# Altium project FPGA2.PrjPcb (part 1 of 2)
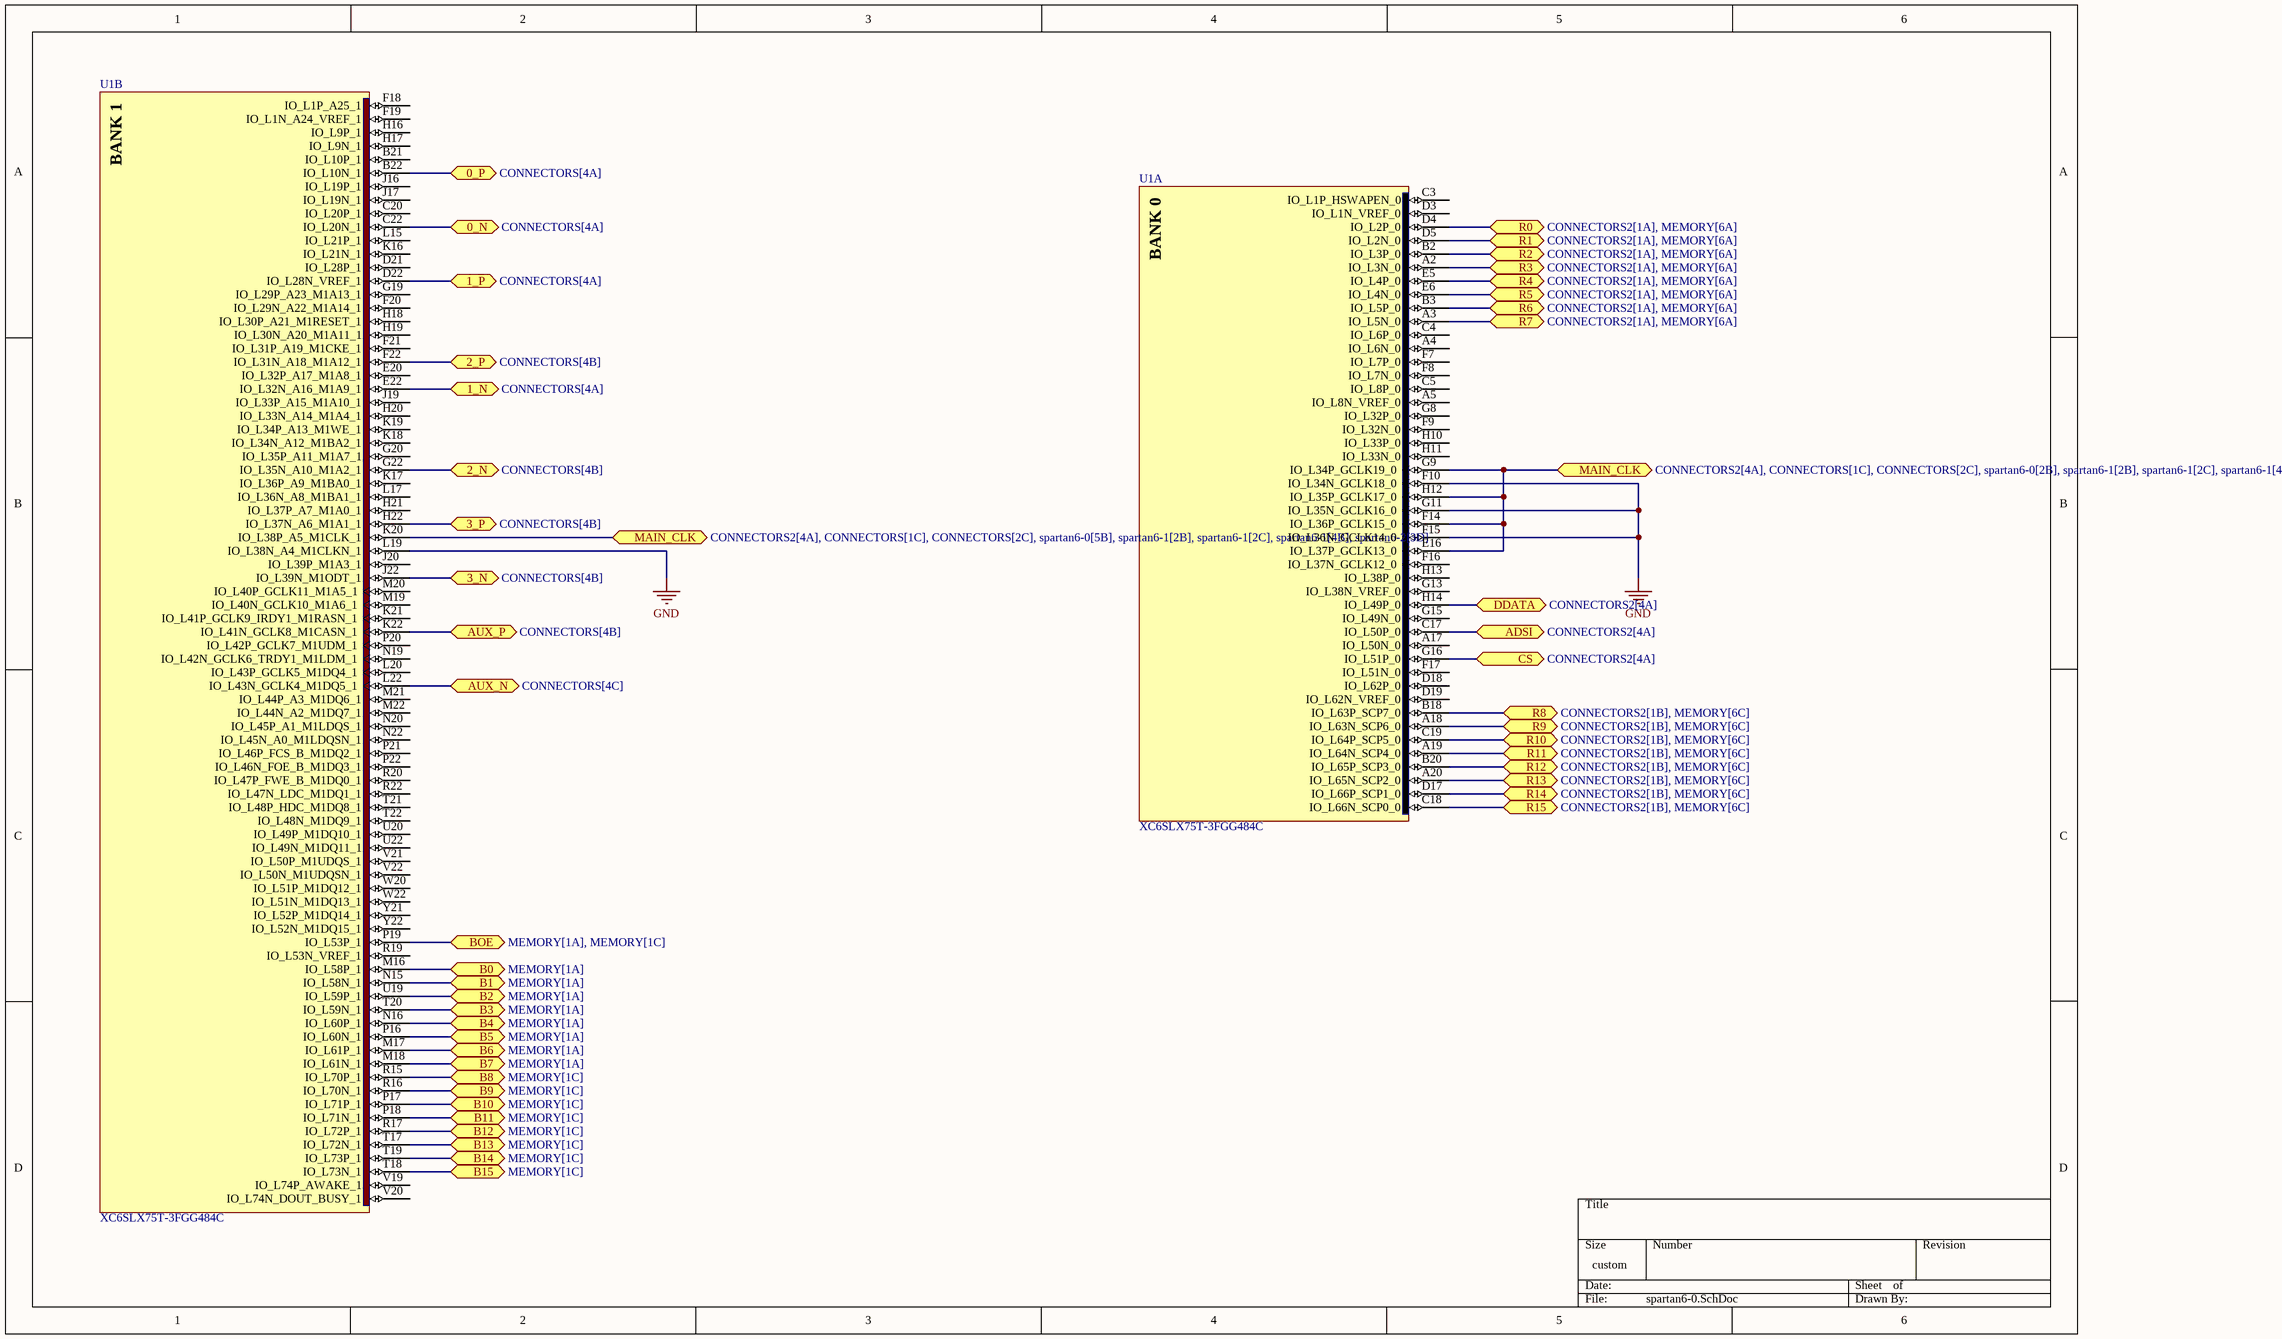
[diagram p0: spartan6-0.SchDoc]
8 sheets, 86 parts. Net scope: flat (ports and power ports of the same name join across sheets).
Board file: SPARTAN-6.PcbDoc
Sheets:
  spartan6-0.SchDoc
  spartan6-1.SchDoc
  spartan6-2.SchDoc
  MEMORY.SchDoc
  POWER.SchDoc
  CONNECTORS.SchDoc
  CONNECTORS2.SchDoc
  MODULES.SchDoc

## Sheet spartan6-0.SchDoc
size 389 x 250 mm; SheetNumber: 1; SheetTotal: 8

### Parts
U1  XC6SLX75T-3FGG484C  [FGG484]  (parts A,B of 9)

### Ports
0_N (bidir, see CONNECTORS[4A]), 0_P (bidir, see CONNECTORS[4A]), 1_N (bidir, see CONNECTORS[4A]), 1_P (bidir, see CONNECTORS[4A]), 2_N (bidir, see CONNECTORS[4B]), 2_P (bidir, see CONNECTORS[4B]), 3_N (bidir, see CONNECTORS[4B]), 3_P (bidir, see CONNECTORS[4B]), ADSI (bidir, see CONNECTORS2[4A]), AUX_N (bidir, see CONNECTORS[4C]), AUX_P (bidir, see CONNECTORS[4B]), B0 (bidir, see MEMORY[1A]), B1 (bidir, see MEMORY[1A]), B2 (bidir, see MEMORY[1A]), B3 (bidir, see MEMORY[1A]), B4 (bidir, see MEMORY[1A]), B5 (bidir, see MEMORY[1A]), B6 (bidir, see MEMORY[1A]), B7 (bidir, see MEMORY[1A]), B8 (bidir, see MEMORY[1C]), B9 (bidir, see MEMORY[1C]), B10 (bidir, see MEMORY[1C]), B11 (bidir, see MEMORY[1C]), B12 (bidir, see MEMORY[1C]), B13 (bidir, see MEMORY[1C]), B14 (bidir, see MEMORY[1C]), B15 (bidir, see MEMORY[1C]), BOE (bidir, see MEMORY[1A], MEMORY[1C]), CS (bidir, see CONNECTORS2[4A]), DDATA (bidir, see CONNECTORS2[4A]), MAIN_CLK (bidir, see CONNECTORS2[4A], CONNECTORS[1C], CONNECTORS[2C], spartan6-0[2B], spartan6-1[2B], spartan6-1[2C], spartan6-1[4B], spartan6-2[3D]), MAIN_CLK (bidir, see CONNECTORS2[4A], CONNECTORS[1C], CONNECTORS[2C], spartan6-0[5B], spartan6-1[2B], spartan6-1[2C], spartan6-1[4B], spartan6-2[3D]), R0 (bidir, see CONNECTORS2[1A], MEMORY[6A]), R1 (bidir, see CONNECTORS2[1A], MEMORY[6A]), R2 (bidir, see CONNECTORS2[1A], MEMORY[6A]), R3 (bidir, see CONNECTORS2[1A], MEMORY[6A]), R4 (bidir, see CONNECTORS2[1A], MEMORY[6A]), R5 (bidir, see CONNECTORS2[1A], MEMORY[6A]), R6 (bidir, see CONNECTORS2[1A], MEMORY[6A]), R7 (bidir, see CONNECTORS2[1A], MEMORY[6A]), R8 (bidir, see CONNECTORS2[1B], MEMORY[6C]), R9 (bidir, see CONNECTORS2[1B], MEMORY[6C]), R10 (bidir, see CONNECTORS2[1B], MEMORY[6C]), R11 (bidir, see CONNECTORS2[1B], MEMORY[6C]), R12 (bidir, see CONNECTORS2[1B], MEMORY[6C]), R13 (bidir, see CONNECTORS2[1B], MEMORY[6C]), R14 (bidir, see CONNECTORS2[1B], MEMORY[6C]), R15 (bidir, see CONNECTORS2[1B], MEMORY[6C])

### Nets
GND: U1.F10(IO_L34N_GCLK18_0) U1.F15(IO_L36N_GCLK14_0) U1.G11(IO_L35N_GCLK16_0) U1.L19(IO_L38N_A4_M1CLKN_1)
0_N: U1.C22(IO_L20N_1) ; port 0_N
0_P: U1.B22(IO_L10N_1) ; port 0_P
1_N: U1.E22(IO_L32N_A16_M1A9_1) ; port 1_N
1_P: U1.D22(IO_L28N_VREF_1) ; port 1_P
2_N: U1.G22(IO_L35N_A10_M1A2_1) ; port 2_N
2_P: U1.F22(IO_L31N_A18_M1A12_1) ; port 2_P
3_N: U1.J22(IO_L39N_M1ODT_1) ; port 3_N
3_P: U1.H22(IO_L37N_A6_M1A1_1) ; port 3_P
AUX_N: U1.L22(IO_L43N_GCLK4_M1DQ5_1) ; port AUX_N
AUX_P: U1.K22(IO_L41N_GCLK8_M1CASN_1) ; port AUX_P
clk: U1.E16(IO_L37P_GCLK13_0) U1.F14(IO_L36P_GCLK15_0) U1.G9(IO_L34P_GCLK19_0) U1.H12(IO_L35P_GCLK17_0) U1.K20(IO_L38P_A5_M1CLK_1) ; port MAIN_CLK
NetJ4_3: U1.A3(IO_L5N_0) ; port R7
NetJ4_4: U1.B3(IO_L5P_0) ; port R6
NetJ4_5: U1.E6(IO_L4N_0) ; port R5
NetJ4_6: U1.E5(IO_L4P_0) ; port R4
NetJ4_7: U1.A2(IO_L3N_0) ; port R3
NetJ4_8: U1.B2(IO_L3P_0) ; port R2
NetJ4_9: U1.D5(IO_L2N_0) ; port R1
NetJ4_10: U1.D4(IO_L2P_0) ; port R0
NetJ5_3: U1.B18(IO_L63P_SCP7_0) ; port R8
NetJ5_4: U1.A18(IO_L63N_SCP6_0) ; port R9
NetJ5_5: U1.C19(IO_L64P_SCP5_0) ; port R10
NetJ5_6: U1.A19(IO_L64N_SCP4_0) ; port R11
NetJ5_7: U1.B20(IO_L65P_SCP3_0) ; port R12
NetJ5_8: U1.A20(IO_L65N_SCP2_0) ; port R13
NetJ5_9: U1.D17(IO_L66P_SCP1_0) ; port R14
NetJ5_10: U1.C18(IO_L66N_SCP0_0) ; port R15
NetR10_2: U1.P19(IO_L53P_1) ; port BOE
NetU1_C17: U1.C17(IO_L50P_0) ; port ADSI
NetU1_G16: U1.G16(IO_L51P_0) ; port CS
NetU1_H14: U1.H14(IO_L49P_0) ; port DDATA
NetU1_M16: U1.M16(IO_L58P_1) ; port B0
NetU1_M17: U1.M17(IO_L61P_1) ; port B6
NetU1_M18: U1.M18(IO_L61N_1) ; port B7
NetU1_N15: U1.N15(IO_L58N_1) ; port B1
NetU1_N16: U1.N16(IO_L60P_1) ; port B4
NetU1_P16: U1.P16(IO_L60N_1) ; port B5
NetU1_P17: U1.P17(IO_L71P_1) ; port B10
NetU1_P18: U1.P18(IO_L71N_1) ; port B11
NetU1_R15: U1.R15(IO_L70P_1) ; port B8
NetU1_R16: U1.R16(IO_L70N_1) ; port B9
NetU1_R17: U1.R17(IO_L72P_1) ; port B12
NetU1_T17: U1.T17(IO_L72N_1) ; port B13
NetU1_T18: U1.T18(IO_L73N_1) ; port B15
NetU1_T19: U1.T19(IO_L73P_1) ; port B14
NetU1_T20: U1.T20(IO_L59N_1) ; port B3
NetU1_U19: U1.U19(IO_L59P_1) ; port B2

Not connected (* = marked no-connect by the designer): U1 A4(IO_L6N_0) A5(IO_L8N_VREF_0) A17(IO_L50N_0) B21(IO_L10P_1) C3(IO_L1P_HSWAPEN_0) C4(IO_L6P_0) C5(IO_L8P_0) C20(IO_L20P_1) D3(IO_L1N_VREF_0) D18(IO_L62P_0) D19(IO_L62N_VREF_0) D21(IO_L28P_1) E20(IO_L32P_A17_M1A8_1) F7(IO_L7P_0) F8(IO_L7N_0) F9(IO_L32N_0) F16(IO_L37N_GCLK12_0) F17(IO_L51N_0) F18(IO_L1P_A25_1) F19(IO_L1N_A24_VREF_1) F20(IO_L29N_A22_M1A14_1) F21(IO_L31P_A19_M1CKE_1) G8(IO_L32P_0) G13(IO_L38N_VREF_0) G15(IO_L49N_0) G19(IO_L29P_A23_M1A13_1) G20(IO_L35P_A11_M1A7_1) H10(IO_L33P_0) H11(IO_L33N_0) H13(IO_L38P_0) H16(IO_L9P_1) H17(IO_L9N_1) H18(IO_L30P_A21_M1RESET_1) H19(IO_L30N_A20_M1A11_1) H20(IO_L33N_A14_M1A4_1) H21(IO_L37P_A7_M1A0_1) J16(IO_L19P_1) J17(IO_L19N_1) J19(IO_L33P_A15_M1A10_1) J20(IO_L39P_M1A3_1) K16(IO_L21N_1) K17(IO_L36P_A9_M1BA0_1) K18(IO_L34N_A12_M1BA2_1) K19(IO_L34P_A13_M1WE_1) K21(IO_L41P_GCLK9_IRDY1_M1RASN_1) L15(IO_L21P_1) L17(IO_L36N_A8_M1BA1_1) L20(IO_L43P_GCLK5_M1DQ4_1) M19(IO_L40N_GCLK10_M1A6_1) M20(IO_L40P_GCLK11_M1A5_1) M21(IO_L44P_A3_M1DQ6_1) M22(IO_L44N_A2_M1DQ7_1) N19(IO_L42N_GCLK6_TRDY1_M1LDM_1) N20(IO_L45P_A1_M1LDQS_1) N22(IO_L45N_A0_M1LDQSN_1) P20(IO_L42P_GCLK7_M1UDM_1) P21(IO_L46P_FCS_B_M1DQ2_1) P22(IO_L46N_FOE_B_M1DQ3_1) R19(IO_L53N_VREF_1) R20(IO_L47P_FWE_B_M1DQ0_1) R22(IO_L47N_LDC_M1DQ1_1) T21(IO_L48P_HDC_M1DQ8_1) T22(IO_L48N_M1DQ9_1) U20(IO_L49P_M1DQ10_1) U22(IO_L49N_M1DQ11_1) V19(IO_L74P_AWAKE_1) V20(IO_L74N_DOUT_BUSY_1) V21(IO_L50P_M1UDQS_1) V22(IO_L50N_M1UDQSN_1) W20(IO_L51P_M1DQ12_1) W22(IO_L51N_M1DQ13_1) Y21(IO_L52P_M1DQ14_1) Y22(IO_L52N_M1DQ15_1)

### Notes on the sheet
- (in symbol CMP-0067-00082-1, part A) BANK 0
- (in symbol CMP-0067-00082-1, part B) BANK 1

### Library data of the parts
U1 = CMP-0067-00082-1: Spartan-6 LXT 1.2V FPGA, 268 User I/Os, 484-Ball Fine-Pitch BGA (1.0mm Pitch), Speed Grade 3, Commercial Grade, Pb-Free; PackageDescription: 484-Ball Fine Pitch Ball Grid Array 1.00 mm Pitch (FGG484) - Pb-Free; PackageVersion: ver1.1, Dec-2008; DatasheetVersion: ver1.6, Nov-2010; Code_JEDEC: MS-034-AAJ-1; Code_IPC: BGA100P22X22-484; PackageReference: FGG484

## Sheet spartan6-1.SchDoc
size 389 x 250 mm; SheetNumber: 2; SheetTotal: 8
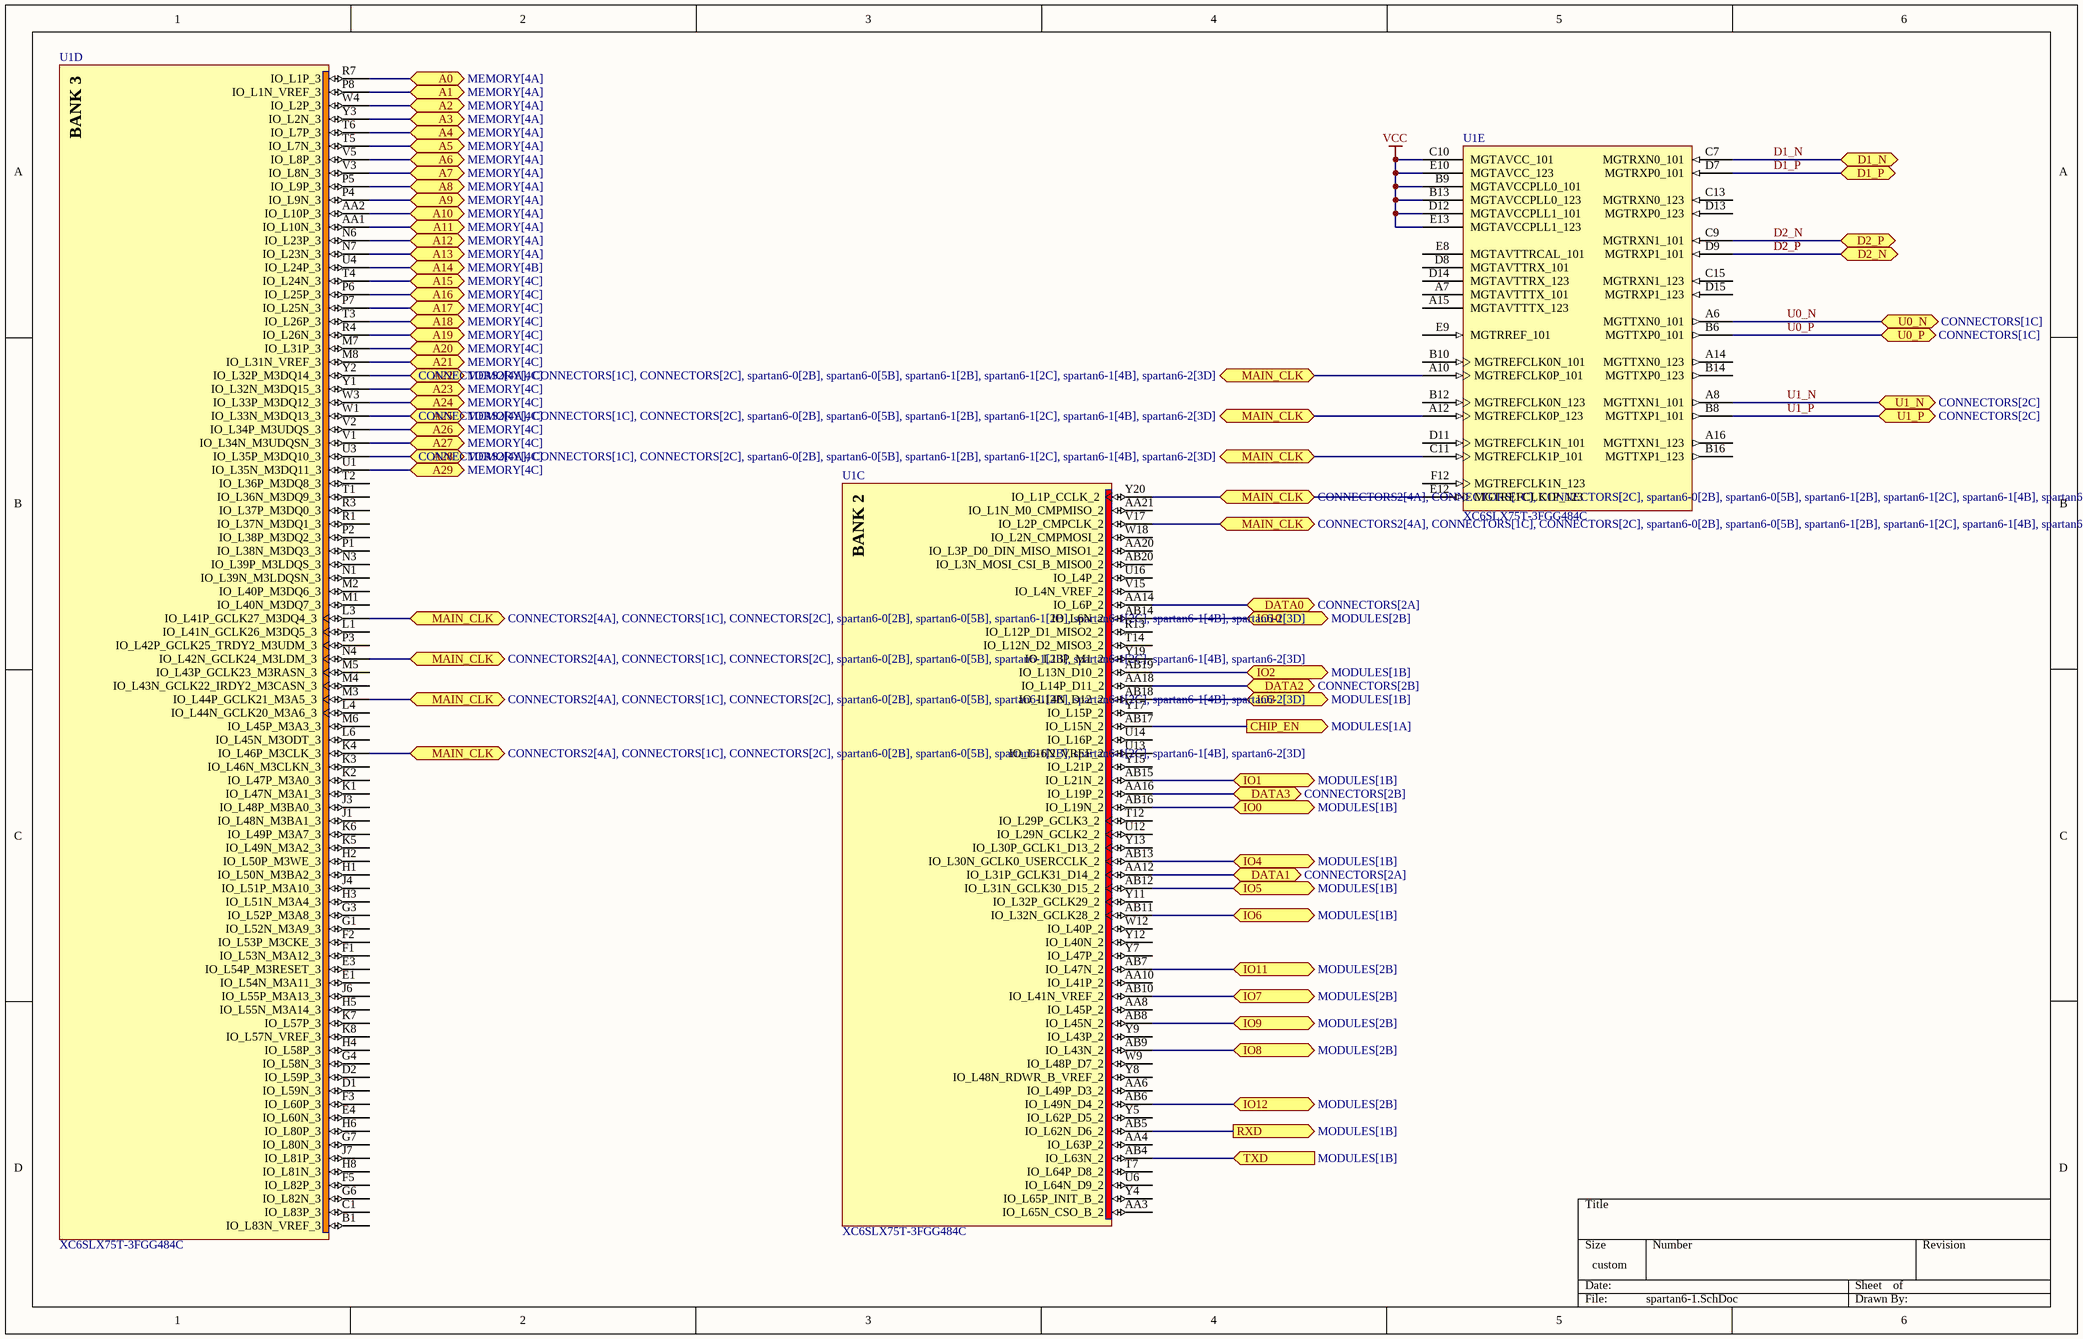
[diagram p1: spartan6-1.SchDoc]

### Parts
U1  XC6SLX75T-3FGG484C  [FGG484]  (parts C,D,E of 9)

### Ports
A0 (bidir, see MEMORY[4A]), A1 (bidir, see MEMORY[4A]), A2 (bidir, see MEMORY[4A]), A3 (bidir, see MEMORY[4A]), A4 (bidir, see MEMORY[4A]), A5 (bidir, see MEMORY[4A]), A6 (bidir, see MEMORY[4A]), A7 (bidir, see MEMORY[4A]), A8 (bidir, see MEMORY[4A]), A9 (bidir, see MEMORY[4A]), A10 (bidir, see MEMORY[4A]), A11 (bidir, see MEMORY[4A]), A12 (bidir, see MEMORY[4A]), A13 (bidir, see MEMORY[4A]), A14 (bidir, see MEMORY[4B]), A15 (bidir, see MEMORY[4C]), A16 (bidir, see MEMORY[4C]), A17 (bidir, see MEMORY[4C]), A18 (bidir, see MEMORY[4C]), A19 (bidir, see MEMORY[4C]), A20 (bidir, see MEMORY[4C]), A21 (bidir, see MEMORY[4C]), A22 (bidir, see MEMORY[4C]), A23 (bidir, see MEMORY[4C]), A24 (bidir, see MEMORY[4C]), A25 (bidir, see MEMORY[4C]), A26 (bidir, see MEMORY[4C]), A27 (bidir, see MEMORY[4C]), A28 (bidir, see MEMORY[4C]), A29 (bidir, see MEMORY[4C]), CHIP_EN (out, see MODULES[1A]), D1_N (bidir), D1_P (bidir), D2_N (bidir), D2_P (bidir), DATA0 (bidir, see CONNECTORS[2A]), DATA1 (bidir, see CONNECTORS[2A]), DATA2 (bidir, see CONNECTORS[2B]), DATA3 (bidir, see CONNECTORS[2B]), IO0 (bidir, see MODULES[1B]), IO1 (bidir, see MODULES[1B]), IO2 (bidir, see MODULES[1B]), IO3 (bidir, see MODULES[1B]), IO4 (bidir, see MODULES[1B]), IO5 (bidir, see MODULES[1B]), IO6 (bidir, see MODULES[1B]), IO7 (bidir, see MODULES[2B]), IO8 (bidir, see MODULES[2B]), IO9 (bidir, see MODULES[2B]), IO10 (bidir, see MODULES[2B]), IO11 (bidir, see MODULES[2B]), IO12 (bidir, see MODULES[2B]), MAIN_CLK (bidir, see CONNECTORS2[4A], CONNECTORS[1C], CONNECTORS[2C], spartan6-0[2B], spartan6-0[5B], spartan6-1[2B], spartan6-1[2C], spartan6-1[4B], spartan6-2[3D]), RXD (out, see MODULES[1B]), TXD (in, see MODULES[1B]), U0_N (bidir, see CONNECTORS[1C]), U0_P (bidir, see CONNECTORS[1C]), U1_N (bidir, see CONNECTORS[2C]), U1_P (bidir, see CONNECTORS[2C])

### Nets
VCC: U1.B9(MGTAVCCPLL0_101) U1.B13(MGTAVCCPLL0_123) U1.C10(MGTAVCC_101) U1.D12(MGTAVCCPLL1_101) U1.E10(MGTAVCC_123) U1.E13(MGTAVCCPLL1_123)
clk: U1.A10(MGTREFCLK0P_101) U1.A12(MGTREFCLK0P_123) U1.C11(MGTREFCLK1P_101) U1.E12(MGTREFCLK1P_123) U1.K4(IO_L46P_M3CLK_3) U1.L3(IO_L41P_GCLK27_M3DQ4_3) U1.M3(IO_L44P_GCLK21_M3A5_3) U1.N4(IO_L42N_GCLK24_M3LDM_3) U1.V17(IO_L2P_CMPCLK_2) U1.Y20(IO_L1P_CCLK_2) ; port MAIN_CLK
D1_N: U1.C7(MGTRXN0_101) ; port D1_N
D1_P: U1.D7(MGTRXP0_101) ; port D1_P
D2_N: U1.C9(MGTRXN1_101) ; port D2_P
D2_P: U1.D9(MGTRXP1_101) ; port D2_N
U0_N: U1.A6(MGTTXN0_101) ; port U0_N
U0_P: U1.B6(MGTTXP0_101) ; port U0_P
U1_N: U1.A8(MGTTXN1_101) ; port U1_N
U1_P: U1.B8(MGTTXP1_101) ; port U1_P
NetJ2_1: U1.AA18(IO_L14P_D11_2) ; port DATA2
NetJ2_2: U1.AA16(IO_L19P_2) ; port DATA3
NetJ2_7: U1.AA14(IO_L6P_2) ; port DATA0
NetJ2_8: U1.AA12(IO_L31P_GCLK31_D14_2) ; port DATA1
NetU1_AA1: U1.AA1(IO_L10N_3) ; port A11
NetU1_AA2: U1.AA2(IO_L10P_3) ; port A10
NetU1_AB4: U1.AB4(IO_L63N_2) ; port TXD
NetU1_AB5: U1.AB5(IO_L62N_D6_2) ; port RXD
NetU1_AB6: U1.AB6(IO_L49N_D4_2) ; port IO12
NetU1_AB7: U1.AB7(IO_L47N_2) ; port IO11
NetU1_AB8: U1.AB8(IO_L45N_2) ; port IO9
NetU1_AB9: U1.AB9(IO_L43N_2) ; port IO8
NetU1_AB10: U1.AB10(IO_L41N_VREF_2) ; port IO7
NetU1_AB11: U1.AB11(IO_L32N_GCLK28_2) ; port IO6
NetU1_AB12: U1.AB12(IO_L31N_GCLK30_D15_2) ; port IO5
NetU1_AB13: U1.AB13(IO_L30N_GCLK0_USERCCLK_2) ; port IO4
NetU1_AB14: U1.AB14(IO_L6N_2) ; port IO10
NetU1_AB15: U1.AB15(IO_L21N_2) ; port IO1
NetU1_AB16: U1.AB16(IO_L19N_2) ; port IO0
NetU1_AB17: U1.AB17(IO_L15N_2) ; port CHIP_EN
NetU1_AB18: U1.AB18(IO_L14N_D12_2) ; port IO3
NetU1_AB19: U1.AB19(IO_L13N_D10_2) ; port IO2
NetU1_M7: U1.M7(IO_L31P_3) ; port A20
NetU1_M8: U1.M8(IO_L31N_VREF_3) ; port A21
NetU1_N6: U1.N6(IO_L23P_3) ; port A12
NetU1_N7: U1.N7(IO_L23N_3) ; port A13
NetU1_P4: U1.P4(IO_L9N_3) ; port A9
NetU1_P5: U1.P5(IO_L9P_3) ; port A8
NetU1_P6: U1.P6(IO_L25P_3) ; port A16
NetU1_P7: U1.P7(IO_L25N_3) ; port A17
NetU1_P8: U1.P8(IO_L1N_VREF_3) ; port A1
NetU1_R4: U1.R4(IO_L26N_3) ; port A19
NetU1_R7: U1.R7(IO_L1P_3) ; port A0
NetU1_T3: U1.T3(IO_L26P_3) ; port A18
NetU1_T4: U1.T4(IO_L24N_3) ; port A15
NetU1_T5: U1.T5(IO_L7N_3) ; port A5
NetU1_T6: U1.T6(IO_L7P_3) ; port A4
NetU1_U1: U1.U1(IO_L35N_M3DQ11_3) ; port A29
NetU1_U3: U1.U3(IO_L35P_M3DQ10_3) ; port A28
NetU1_U4: U1.U4(IO_L24P_3) ; port A14
NetU1_V1: U1.V1(IO_L34N_M3UDQSN_3) ; port A27
NetU1_V2: U1.V2(IO_L34P_M3UDQS_3) ; port A26
NetU1_V3: U1.V3(IO_L8N_3) ; port A7
NetU1_V5: U1.V5(IO_L8P_3) ; port A6
NetU1_W1: U1.W1(IO_L33N_M3DQ13_3) ; port A25
NetU1_W3: U1.W3(IO_L33P_M3DQ12_3) ; port A24
NetU1_W4: U1.W4(IO_L2P_3) ; port A2
NetU1_Y1: U1.Y1(IO_L32N_M3DQ15_3) ; port A23
NetU1_Y2: U1.Y2(IO_L32P_M3DQ14_3) ; port A22
NetU1_Y3: U1.Y3(IO_L2N_3) ; port A3

Not connected (* = marked no-connect by the designer): U1 A7(MGTAVTTTX_101) A14(MGTTXN0_123) A15(MGTAVTTTX_123) A16(MGTTXN1_123) AA3(IO_L65N_CSO_B_2) AA4(IO_L63P_2) AA6(IO_L49P_D3_2) AA8(IO_L45P_2) AA10(IO_L41P_2) AA20(IO_L3P_D0_DIN_MISO_MISO1_2) AA21(IO_L1N_M0_CMPMISO_2) AB20(IO_L3N_MOSI_CSI_B_MISO0_2) B1(IO_L83N_VREF_3) B10(MGTREFCLK0N_101) B12(MGTREFCLK0N_123) B14(MGTTXP0_123) B16(MGTTXP1_123) C1(IO_L83P_3) C13(MGTRXN0_123) C15(MGTRXN1_123) D1(IO_L59N_3) D2(IO_L59P_3) D8(MGTAVTTRX_101) D11(MGTREFCLK1N_101) D13(MGTRXP0_123) D14(MGTAVTTRX_123) D15(MGTRXP1_123) E1(IO_L54N_M3A11_3) E3(IO_L54P_M3RESET_3) E4(IO_L60N_3) E8(MGTAVTTRCAL_101) E9(MGTRREF_101) F1(IO_L53N_M3A12_3) F2(IO_L53P_M3CKE_3) F3(IO_L60P_3) F5(IO_L82P_3) F12(MGTREFCLK1N_123) G1(IO_L52N_M3A9_3) G3(IO_L52P_M3A8_3) G4(IO_L58N_3) G6(IO_L82N_3) G7(IO_L80N_3) H1(IO_L50N_M3BA2_3) H2(IO_L50P_M3WE_3) H3(IO_L51N_M3A4_3) H4(IO_L58P_3) H5(IO_L55N_M3A14_3) H6(IO_L80P_3) H8(IO_L81N_3) J1(IO_L48N_M3BA1_3) J3(IO_L48P_M3BA0_3) J4(IO_L51P_M3A10_3) J6(IO_L55P_M3A13_3) J7(IO_L81P_3) K1(IO_L47N_M3A1_3) K2(IO_L47P_M3A0_3) K3(IO_L46N_M3CLKN_3) K5(IO_L49N_M3A2_3) K6(IO_L49P_M3A7_3) K7(IO_L57P_3) K8(IO_L57N_VREF_3) L1(IO_L41N_GCLK26_M3DQ5_3) L4(IO_L44N_GCLK20_M3A6_3) L6(IO_L45N_M3ODT_3) M1(IO_L40N_M3DQ7_3) M2(IO_L40P_M3DQ6_3) M4(IO_L43N_GCLK22_IRDY2_M3CASN_3) M5(IO_L43P_GCLK23_M3RASN_3) M6(IO_L45P_M3A3_3) N1(IO_L39N_M3LDQSN_3) N3(IO_L39P_M3LDQS_3) P1(IO_L38N_M3DQ3_3) P2(IO_L38P_M3DQ2_3) P3(IO_L42P_GCLK25_TRDY2_M3UDM_3) R1(IO_L37N_M3DQ1_3) R3(IO_L37P_M3DQ0_3) R13(IO_L12P_D1_MISO2_2) T1(IO_L36N_M3DQ9_3) T2(IO_L36P_M3DQ8_3) T7(IO_L64P_D8_2) T12(IO_L29P_GCLK3_2) T14(IO_L12N_D2_MISO3_2) U6(IO_L64N_D9_2) U12(IO_L29N_GCLK2_2) U13(IO_L16N_VREF_2) U14(IO_L16P_2) U16(IO_L4P_2) V15(IO_L4N_VREF_2) W9(IO_L48P_D7_2) W12(IO_L40P_2) W18(IO_L2N_CMPMOSI_2) Y4(IO_L65P_INIT_B_2) Y5(IO_L62P_D5_2) Y7(IO_L47P_2) Y8(IO_L48N_RDWR_B_VREF_2) Y9(IO_L43P_2) Y11(IO_L32P_GCLK29_2) Y12(IO_L40N_2) Y13(IO_L30P_GCLK1_D13_2) Y15(IO_L21P_2) Y17(IO_L15P_2) Y19(IO_L13P_M1_2)

### Notes on the sheet
- (in symbol CMP-0067-00082-1, part C) BANK 2
- (in symbol CMP-0067-00082-1, part D) BANK 3

### Library data of the parts
U1 = CMP-0067-00082-1: as U1 on sheet spartan6-0; PackageDescription: 484-Ball Fine Pitch Ball Grid Array 1.00 mm Pitch (FGG484) - Pb-Free; PackageVersion: ver1.1, Dec-2008; DatasheetVersion: ver1.6, Nov-2010; Code_JEDEC: MS-034-AAJ-1; Code_IPC: BGA100P22X22-484; PackageReference: FGG484

## Sheet spartan6-2.SchDoc
size 389 x 250 mm; SheetNumber: 3; SheetTotal: 8
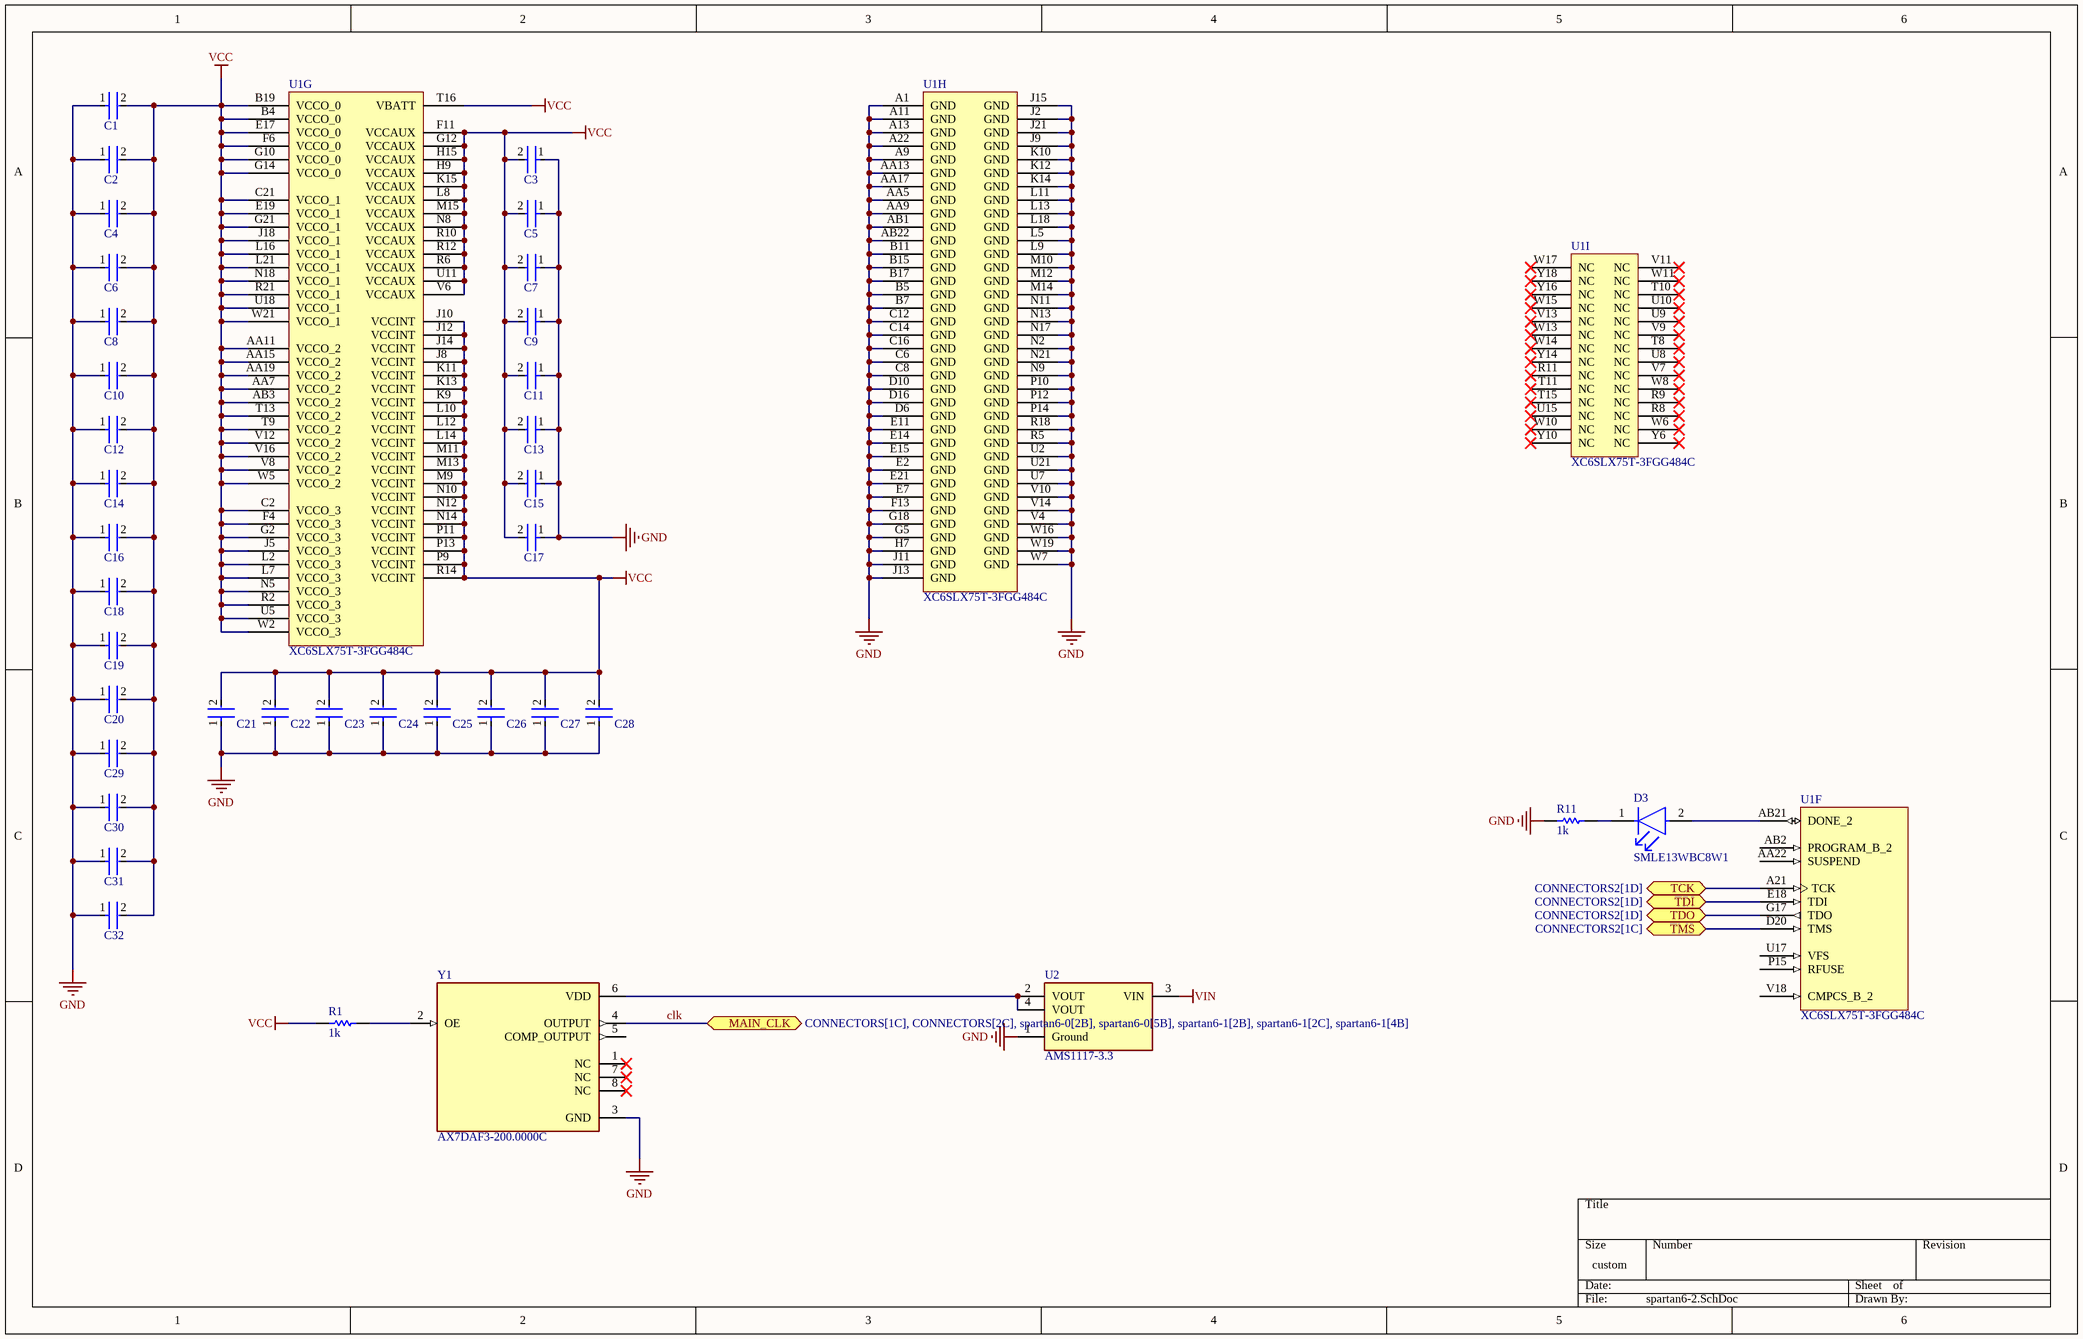
[diagram p2: spartan6-2.SchDoc]

### Parts
C1  C0603X6S0G474M030BC  [FP-C0603-030-0_03-MFG]  (value not drawn)
C2  C0603X6S0G474M030BC  [FP-C0603-030-0_03-MFG]  (value not drawn)
C3  C0603X6S0G474M030BC  [FP-C0603-030-0_03-MFG]  (value not drawn)
C4  C0603X6S0G474M030BC  [FP-C0603-030-0_03-MFG]  (value not drawn)
C5  C0603X6S0G474M030BC  [FP-C0603-030-0_03-MFG]  (value not drawn)
C6  C0603X6S0G474M030BC  [FP-C0603-030-0_03-MFG]  (value not drawn)
C7  C0603X6S0G474M030BC  [FP-C0603-030-0_03-MFG]  (value not drawn)
C8  C0603X6S0G474M030BC  [FP-C0603-030-0_03-MFG]  (value not drawn)
C9  C0603X6S0G474M030BC  [FP-C0603-030-0_03-MFG]  (value not drawn)
C10  C0603X6S0G474M030BC  [FP-C0603-030-0_03-MFG]  (value not drawn)
C11  C0603X6S0G474M030BC  [FP-C0603-030-0_03-MFG]  (value not drawn)
C12  C0603X6S0G474M030BC  [FP-C0603-030-0_03-MFG]  (value not drawn)
C13  C0603X6S0G474M030BC  [FP-C0603-030-0_03-MFG]  (value not drawn)
C14  C0603X6S0G474M030BC  [FP-C0603-030-0_03-MFG]  (value not drawn)
C15  C0603X6S0G474M030BC  [FP-C0603-030-0_03-MFG]  (value not drawn)
C16  C0603X6S0G474M030BC  [FP-C0603-030-0_03-MFG]  (value not drawn)
C17  C0603X6S0G474M030BC  [FP-C0603-030-0_03-MFG]  (value not drawn)
C18  C0603X6S0G474M030BC  [FP-C0603-030-0_03-MFG]  (value not drawn)
C19  C0603X6S0G474M030BC  [FP-C0603-030-0_03-MFG]  (value not drawn)
C20  C0603X6S0G474M030BC  [FP-C0603-030-0_03-MFG]  (value not drawn)
C21  C0603X6S0G474M030BC  [FP-C0603-030-0_03-MFG]  (value not drawn)
C22  C0603X6S0G474M030BC  [FP-C0603-030-0_03-MFG]  (value not drawn)
C23  C0603X6S0G474M030BC  [FP-C0603-030-0_03-MFG]  (value not drawn)
C24  C0603X6S0G474M030BC  [FP-C0603-030-0_03-MFG]  (value not drawn)
C25  C0603X6S0G474M030BC  [FP-C0603-030-0_03-MFG]  (value not drawn)
C26  C0603X6S0G474M030BC  [FP-C0603-030-0_03-MFG]  (value not drawn)
C27  C0603X6S0G474M030BC  [FP-C0603-030-0_03-MFG]  (value not drawn)
C28  C0603X6S0G474M030BC  [FP-C0603-030-0_03-MFG]  (value not drawn)
C29  C0603X6S0G474M030BC  [FP-C0603-030-0_03-MFG]  (value not drawn)
C30  C0603X6S0G474M030BC  [FP-C0603-030-0_03-MFG]  (value not drawn)
C31  C0603X6S0G474M030BC  [FP-C0603-030-0_03-MFG]  (value not drawn)
C32  C0603X6S0G474M030BC  [FP-C0603-030-0_03-MFG]  (value not drawn)
D3  SMLE13WBC8W1  [FP-SMLE13WBC8W1-MFG]
R1  1k  [RESC2013X60X35ML10T20]
R11  1k  [RESC2013X60X35ML10T20]
U1  XC6SLX75T-3FGG484C  [FGG484]  (parts F,G,H,I of 9)
U2  AMS1117-3.3  [FP-AMS1117-IPC_C]
Y1  AX7DAF3-200.0000C  [OSC_AX7DAF3-200.0000C]

### Ports
MAIN_CLK (bidir, see CONNECTORS[1C], CONNECTORS[2C], spartan6-0[2B], spartan6-0[5B], spartan6-1[2B], spartan6-1[2C], spartan6-1[4B]), TCK (bidir, see CONNECTORS2[1D]), TDI (bidir, see CONNECTORS2[1D]), TDO (bidir, see CONNECTORS2[1D]), TMS (bidir, see CONNECTORS2[1C])

### Nets
GND: C1.1 C2.1 C3.1 C4.1 C5.1 C6.1 C7.1 C8.1 C9.1 C10.1 C11.1 C12.1 C13.1 C14.1 C15.1 C16.1 C17.1 C18.1 C19.1 C20.1 C21.1 C22.1 C23.1 C24.1 C25.1 C26.1 C27.1 C28.1 C29.1 C30.1 C31.1 C32.1 R11.1 U1.A1(GND) U1.A9(GND) U1.A11(GND) U1.A13(GND) U1.A22(GND) U1.AA5(GND) U1.AA9(GND) U1.AA13(GND) U1.AA17(GND) U1.AB1(GND) U1.AB22(GND) U1.B5(GND) U1.B7(GND) U1.B11(GND) U1.B15(GND) U1.B17(GND) U1.C6(GND) U1.C8(GND) U1.C12(GND) U1.C14(GND) U1.C16(GND) U1.D6(GND) U1.D10(GND) U1.D16(GND) U1.E2(GND) U1.E7(GND) U1.E11(GND) U1.E14(GND) U1.E15(GND) U1.E21(GND) U1.F13(GND) U1.G5(GND) U1.G18(GND) U1.H7(GND) U1.J2(GND) U1.J9(GND) U1.J11(GND) U1.J13(GND) U1.J15(GND) U1.J21(GND) U1.K10(GND) U1.K12(GND) U1.K14(GND) U1.L5(GND) U1.L9(GND) U1.L11(GND) U1.L13(GND) U1.L18(GND) U1.M10(GND) U1.M12(GND) U1.M14(GND) U1.N2(GND) U1.N9(GND) U1.N11(GND) U1.N13(GND) U1.N17(GND) U1.N21(GND) U1.P10(GND) U1.P12(GND) U1.P14(GND) U1.R5(GND) U1.R18(GND) U1.U2(GND) U1.U7(GND) U1.U21(GND) U1.V4(GND) U1.V10(GND) U1.V14(GND) U1.W7(GND) U1.W16(GND) U1.W19(GND) U2.1(Ground) Y1.3(GND)
VCC: C1.2 C2.2 C3.2 C4.2 C5.2 C6.2 C7.2 C8.2 C9.2 C10.2 C11.2 C12.2 C13.2 C14.2 C15.2 C16.2 C17.2 C18.2 C19.2 C20.2 C21.2 C22.2 C23.2 C24.2 C25.2 C26.2 C27.2 C28.2 C29.2 C30.2 C31.2 C32.2 R1.1 U1.AA7(VCCO_2) U1.AA11(VCCO_2) U1.AA15(VCCO_2) U1.AA19(VCCO_2) U1.AB3(VCCO_2) U1.B4(VCCO_0) U1.B19(VCCO_0) U1.C2(VCCO_3) U1.C21(VCCO_1) U1.E17(VCCO_0) U1.E19(VCCO_1) U1.F4(VCCO_3) U1.F6(VCCO_0) U1.F11(VCCAUX) U1.G2(VCCO_3) U1.G10(VCCO_0) U1.G12(VCCAUX) U1.G14(VCCO_0) U1.G21(VCCO_1) U1.H9(VCCAUX) U1.H15(VCCAUX) U1.J5(VCCO_3) U1.J8(VCCINT) U1.J10(VCCINT) U1.J12(VCCINT) U1.J14(VCCINT) U1.J18(VCCO_1) U1.K9(VCCINT) U1.K11(VCCINT) U1.K13(VCCINT) U1.K15(VCCAUX) U1.L2(VCCO_3) U1.L7(VCCO_3) U1.L8(VCCAUX) U1.L10(VCCINT) U1.L12(VCCINT) U1.L14(VCCINT) U1.L16(VCCO_1) U1.L21(VCCO_1) U1.M9(VCCINT) U1.M11(VCCINT) U1.M13(VCCINT) U1.M15(VCCAUX) U1.N5(VCCO_3) U1.N8(VCCAUX) U1.N10(VCCINT) U1.N12(VCCINT) U1.N14(VCCINT) U1.N18(VCCO_1) U1.P9(VCCINT) U1.P11(VCCINT) U1.P13(VCCINT) U1.R2(VCCO_3) U1.R6(VCCAUX) U1.R10(VCCAUX) U1.R12(VCCAUX) U1.R14(VCCINT) U1.R21(VCCO_1) U1.T9(VCCO_2) U1.T13(VCCO_2) U1.T16(VBATT) U1.U5(VCCO_3) U1.U11(VCCAUX) U1.U18(VCCO_1) U1.V6(VCCAUX) U1.V8(VCCO_2) U1.V12(VCCO_2) U1.V16(VCCO_2) U1.W2(VCCO_3) U1.W5(VCCO_2) U1.W21(VCCO_1)
VIN: U2.3(VIN)
clk: Y1.4(OUTPUT) ; port MAIN_CLK
NetD3_1: D3.1(C) R11.2
NetD3_2: D3.2(A) U1.AB21(DONE_2)
NetJ8_1: U1.D20(TMS) ; port TMS
NetJ8_3: U1.E18(TDI) ; port TDI
NetJ8_7: U1.G17(TDO) ; port TDO
NetJ8_9: U1.A21(TCK) ; port TCK
NetR1_2: R1.2 Y1.2(OE)
NetU2_2: U2.2(VOUT) U2.4(VOUT) Y1.6(VDD)

Not connected (* = marked no-connect by the designer): U1 AA22(SUSPEND) AB2(PROGRAM_B_2) P15(RFUSE) R8(NC)* R9(NC)* R11(NC)* T8(NC)* T10(NC)* T11(NC)* T15(NC)* U8(NC)* U9(NC)* U10(NC)* U15(NC)* U17(VFS) V7(NC)* V9(NC)* V11(NC)* V13(NC)* V18(CMPCS_B_2) W6(NC)* W8(NC)* W10(NC)* W11(NC)* W13(NC)* W14(NC)* W15(NC)* W17(NC)* Y6(NC)* Y10(NC)* Y14(NC)* Y16(NC)* Y18(NC)*; Y1 1(NC)* 5(COMP_OUTPUT) 7(NC)* 8(NC)*

### Library data of the parts
C1-C32 = CMP-08246-002636-1: Multilayer Ceramic Capacitors 470nF ±20% 4V X6S SMD 0201; Dielectric Material: Ceramic; RoHS Compliant: Yes; Case Code (Imperial): 0201; Voltage Rating: 4V; Series: C; Case/Package: 0201; Max Operating Temperature: 105°C; Width: 0.3mm; Termination: SMD/SMT; Lead Free: Lead Free; Capacitance: 470nF; Tolerance: 20%; Mount: Surface Mount; Thickness: 0.013inch; Package Quantity: 15000; Case Code (Metric): 0603; Height: 0.3mm; Weight: 6E-06oz; Length: 0.024inch; Packaging: Tape and Reel; Min Operating Temperature: -55°C; Voltage Rating (DC): 4V; Dielectric: X6S
D3 = CMP-08952-000004-1: LED WHITE 0603 SMD; Manufacturer: Rohm; Luminous Intensity: 140mcd; Led Orientation: Top View; Reverse Voltage: 5V; Forward Voltage: 2.9V; Forward Current: 5mA; Power Dissipation: 66mW; Temperature Range Low: -40°C; Digikey Description: LED WHITE 0603 SMD; Temperature Range High: +85°C; Temperature: -40°C to +85°C; Manufacturer Part Number: SMLE13WBC8W1; Colour: White; Mouser Description: Standard LEDs - SMD ExceLED White LED 120mcd 5mA; Octopart: https://octopart.com/smle13wbc8w1-rohm-22224565; Automotive: No; Device Class L2: LEDs; Lead Free: Yes; ComponentLink2URL: https://media.digikey.com/pdf/Data%20Sheets/Rohm%20PDFs/SMLE13WBC8W1_Spec.pdf; Device Class L3: unset; Package: 0; RoHS: TRUE; Height: 0.4mm; Category: Diode; Device Class L1: Optoelectronics; ComponentLink2Description: Datasheet
R1 R11 = CMP-2100-03673-1: Chip Resistor, 0 Ohm, Jumper, +/- 5%, 0.125 W, -55 to 155 degC, 0805 (2012 Metric), RoHS, Tape and Reel; Manufacturer: Yageo; Power Rating: 125mW; Resistance: 0mOhm; Voltage Rating (DC): 150V; Temperature Coefficient: 200ppm/degreesC; Height: 0.5mm; Depth: 1.25mm; Case Code (Imperial): 0805; Lead Free: LeadFree; Military Standard: Not; Package Description: 2-Pin Surface Mounted Device, Body 2 x 1.25 mm; Case Code (Metric): 2012; Composition: ThickFilm; Voltage Rating: 150V; Manufacturer URL: http://www.yageo.com/; Packaging: TapeandReel; Package Reference: 0805; REACH SVHC: Unknown; Tolerance: 5%; Case/Package: 0805; Max Operating Temperature: 155degC; Number of Pins: 2; Min Operating Temperature: -55degC; RoHSCompliant: true; Length: 2mm; Datasheet URL: http://www.yageo.com/NewPortal/yageodocoutput?fileName=/pdf/R-Chip/PYu-RC_Group_51_RoHS_L_5.pdf; Termination: SMD/SMT; Radiation Hardening: No; Width: 1.25mm; Contact Plating: Tin; Datasheet Version: Rev. 5, 10/2016
U1 = CMP-0067-00082-1: as U1 on sheet spartan6-0; PackageDescription: 484-Ball Fine Pitch Ball Grid Array 1.00 mm Pitch (FGG484) - Pb-Free; PackageVersion: ver1.1, Dec-2008; DatasheetVersion: ver1.6, Nov-2010; Code_JEDEC: MS-034-AAJ-1; Code_IPC: BGA100P22X22-484; PackageReference: FGG484
U2 = CMP-209535-000001-1: LDO Voltage Regulators 1A, 3.3V; Manufacturer: Advanced Monolithic Systems; Dropout Voltage: 1.1V; Output Type: Fixed; Nominal Supply Current: 5mA; Max Power Dissipation: 1.2W; Max Supply Voltage: 15V; Number Of Outputs: 1; Standoff Height: 0.64mm; Max Junction Temp: +125°C; Height: 1.8mm; Package: AMS1117; Device Class L2: Power Management ICs; ComponentLink2Description: Datasheet; ComponentLink2URL: http://www.advanced-monolithic.com/pdf/ds1117.pdf; Category: IC; RoHS: TRUE; Automotive: No; Device Class L1: Integrated Circuits (ICs); Output Current: 1A; Device Class L3: Voltage Regulators - Linear; Temperature: -40°C to +125°C; Output Voltage: 3.3V; Manufacturer Part Number: AMS1117-3.3; Temperature Range Low: -40°C; Octopart: https://octopart.com/ams1117-3.3-advanced+monolithic+systems-25899300; Lead Free: Yes; Ipc Land Pattern Name: SOT229P700X180-4; Temperature Range High: +125°C
Y1 = AX7DAF3-200.0000C: MF: {'manufacturer': u'Abracon LLC'}; Package: None; Price: None; Value: *; MP: AX7DAF3-200.0000C; Availability: Unavailable

## Sheet MEMORY.SchDoc
size 389 x 250 mm; SheetNumber: 4; SheetTotal: 8
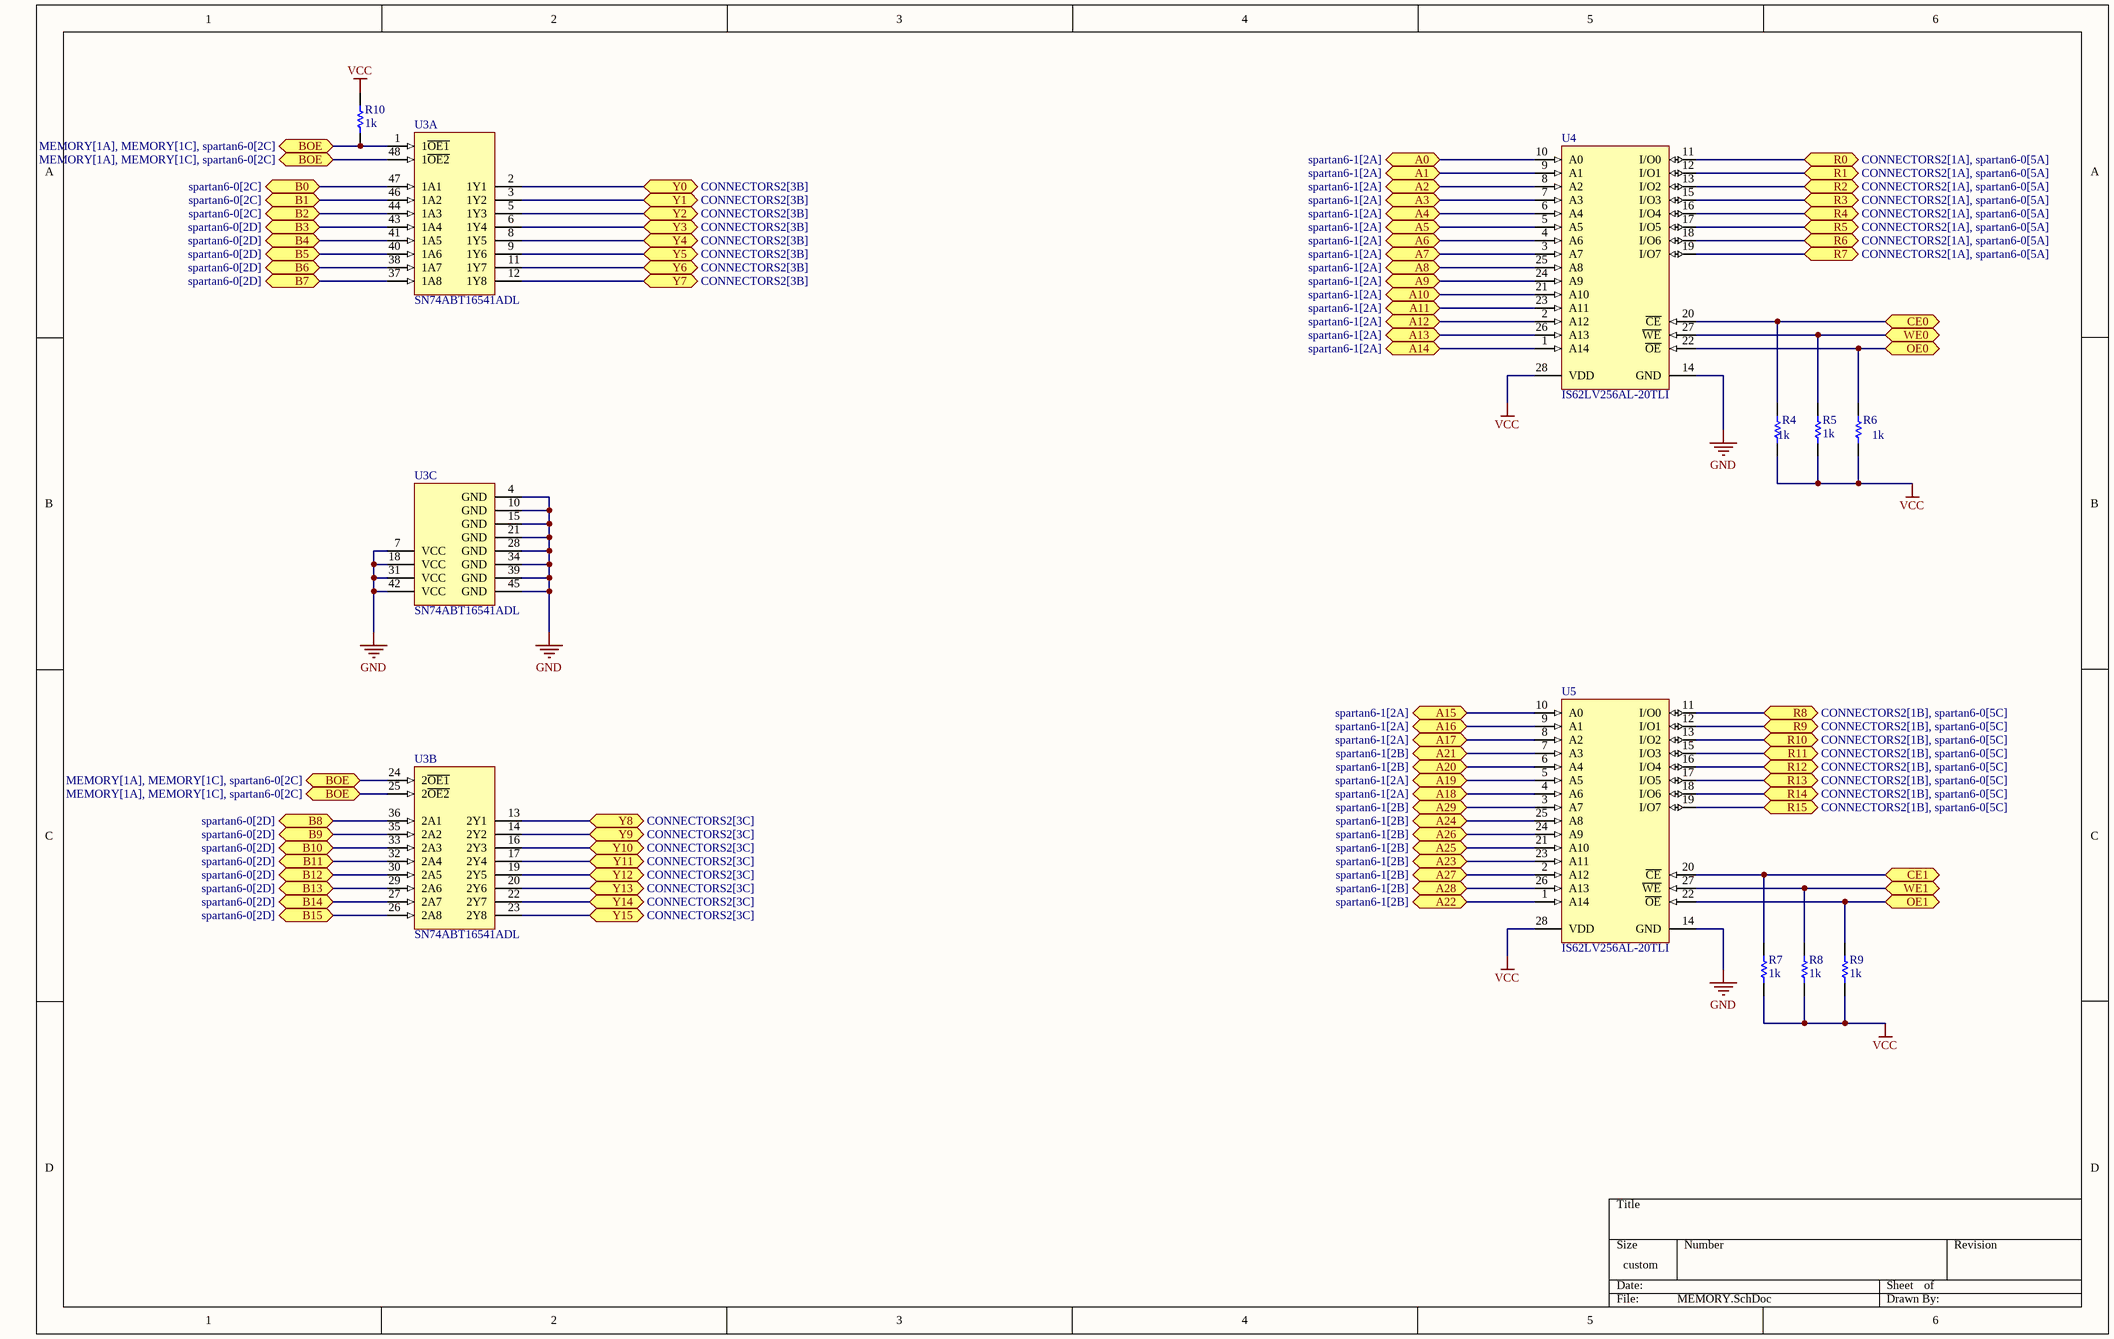
[diagram p3: MEMORY.SchDoc]

### Parts
R4  1k  [RESC2013X60X35ML10T20]
R5  1k  [RESC2013X60X35ML10T20]
R6  1k  [RESC2013X60X35ML10T20]
R7  1k  [RESC2013X60X35ML10T20]
R8  1k  [RESC2013X60X35ML10T20]
R9  1k  [RESC2013X60X35ML10T20]
R10  1k  [RESC2013X60X35ML10T20]
U3  SN74ABT16541ADL  [DL0048A_L]  (parts A,B,C of 3)
U4  IS62LV256AL-20TLI  [ISSI-TSOP-1-28-8000X13400DE_N]
U5  IS62LV256AL-20TLI  [ISSI-TSOP-1-28-8000X13400DE_N]

### Ports
A0 (bidir, see spartan6-1[2A]), A1 (bidir, see spartan6-1[2A]), A2 (bidir, see spartan6-1[2A]), A3 (bidir, see spartan6-1[2A]), A4 (bidir, see spartan6-1[2A]), A5 (bidir, see spartan6-1[2A]), A6 (bidir, see spartan6-1[2A]), A7 (bidir, see spartan6-1[2A]), A8 (bidir, see spartan6-1[2A]), A9 (bidir, see spartan6-1[2A]), A10 (bidir, see spartan6-1[2A]), A11 (bidir, see spartan6-1[2A]), A12 (bidir, see spartan6-1[2A]), A13 (bidir, see spartan6-1[2A]), A14 (bidir, see spartan6-1[2A]), A15 (bidir, see spartan6-1[2A]), A16 (bidir, see spartan6-1[2A]), A17 (bidir, see spartan6-1[2A]), A18 (bidir, see spartan6-1[2A]), A19 (bidir, see spartan6-1[2A]), A20 (bidir, see spartan6-1[2B]), A21 (bidir, see spartan6-1[2B]), A22 (bidir, see spartan6-1[2B]), A23 (bidir, see spartan6-1[2B]), A24 (bidir, see spartan6-1[2B]), A25 (bidir, see spartan6-1[2B]), A26 (bidir, see spartan6-1[2B]), A27 (bidir, see spartan6-1[2B]), A28 (bidir, see spartan6-1[2B]), A29 (bidir, see spartan6-1[2B]), B0 (bidir, see spartan6-0[2C]), B1 (bidir, see spartan6-0[2C]), B2 (bidir, see spartan6-0[2C]), B3 (bidir, see spartan6-0[2D]), B4 (bidir, see spartan6-0[2D]), B5 (bidir, see spartan6-0[2D]), B6 (bidir, see spartan6-0[2D]), B7 (bidir, see spartan6-0[2D]), B8 (bidir, see spartan6-0[2D]), B9 (bidir, see spartan6-0[2D]), B10 (bidir, see spartan6-0[2D]), B11 (bidir, see spartan6-0[2D]), B12 (bidir, see spartan6-0[2D]), B13 (bidir, see spartan6-0[2D]), B14 (bidir, see spartan6-0[2D]), B15 (bidir, see spartan6-0[2D]), BOE (bidir, see MEMORY[1A], MEMORY[1C], spartan6-0[2C]), CE0 (bidir), CE1 (bidir), OE0 (bidir), OE1 (bidir), R0 (bidir, see CONNECTORS2[1A], spartan6-0[5A]), R1 (bidir, see CONNECTORS2[1A], spartan6-0[5A]), R2 (bidir, see CONNECTORS2[1A], spartan6-0[5A]), R3 (bidir, see CONNECTORS2[1A], spartan6-0[5A]), R4 (bidir, see CONNECTORS2[1A], spartan6-0[5A]), R5 (bidir, see CONNECTORS2[1A], spartan6-0[5A]), R6 (bidir, see CONNECTORS2[1A], spartan6-0[5A]), R7 (bidir, see CONNECTORS2[1A], spartan6-0[5A]), R8 (bidir, see CONNECTORS2[1B], spartan6-0[5C]), R9 (bidir, see CONNECTORS2[1B], spartan6-0[5C]), R10 (bidir, see CONNECTORS2[1B], spartan6-0[5C]), R11 (bidir, see CONNECTORS2[1B], spartan6-0[5C]), R12 (bidir, see CONNECTORS2[1B], spartan6-0[5C]), R13 (bidir, see CONNECTORS2[1B], spartan6-0[5C]), R14 (bidir, see CONNECTORS2[1B], spartan6-0[5C]), R15 (bidir, see CONNECTORS2[1B], spartan6-0[5C]), WE0 (bidir), WE1 (bidir), Y0 (bidir, see CONNECTORS2[3B]), Y1 (bidir, see CONNECTORS2[3B]), Y2 (bidir, see CONNECTORS2[3B]), Y3 (bidir, see CONNECTORS2[3B]), Y4 (bidir, see CONNECTORS2[3B]), Y5 (bidir, see CONNECTORS2[3B]), Y6 (bidir, see CONNECTORS2[3B]), Y7 (bidir, see CONNECTORS2[3B]), Y8 (bidir, see CONNECTORS2[3C]), Y9 (bidir, see CONNECTORS2[3C]), Y10 (bidir, see CONNECTORS2[3C]), Y11 (bidir, see CONNECTORS2[3C]), Y12 (bidir, see CONNECTORS2[3C]), Y13 (bidir, see CONNECTORS2[3C]), Y14 (bidir, see CONNECTORS2[3C]), Y15 (bidir, see CONNECTORS2[3C])

### Nets
GND: U3.4(GND) U3.7(VCC) U3.10(GND) U3.15(GND) U3.18(VCC) U3.21(GND) U3.28(GND) U3.31(VCC) U3.34(GND) U3.39(GND) U3.42(VCC) U3.45(GND) U4.14(GND) U5.14(GND)
VCC: R4.2 R5.2 R6.2 R7.2 R8.2 R9.2 R10.1 U4.28(VDD) U5.28(VDD)
NetJ4_3: U4.19(I/O7) ; port R7
NetJ4_4: U4.18(I/O6) ; port R6
NetJ4_5: U4.17(I/O5) ; port R5
NetJ4_6: U4.16(I/O4) ; port R4
NetJ4_7: U4.15(I/O3) ; port R3
NetJ4_8: U4.13(I/O2) ; port R2
NetJ4_9: U4.12(I/O1) ; port R1
NetJ4_10: U4.11(I/O0) ; port R0
NetJ5_3: U5.11(I/O0) ; port R8
NetJ5_4: U5.12(I/O1) ; port R9
NetJ5_5: U5.13(I/O2) ; port R10
NetJ5_6: U5.15(I/O3) ; port R11
NetJ5_7: U5.16(I/O4) ; port R12
NetJ5_8: U5.17(I/O5) ; port R13
NetJ5_9: U5.18(I/O6) ; port R14
NetJ5_10: U5.19(I/O7) ; port R15
NetJ6_3: U3.12(1Y8) ; port Y7
NetJ6_4: U3.11(1Y7) ; port Y6
NetJ6_5: U3.9(1Y6) ; port Y5
NetJ6_6: U3.8(1Y5) ; port Y4
NetJ6_7: U3.6(1Y4) ; port Y3
NetJ6_8: U3.5(1Y3) ; port Y2
NetJ6_9: U3.3(1Y2) ; port Y1
NetJ6_10: U3.2(1Y1) ; port Y0
NetJ7_3: U3.13(2Y1) ; port Y8
NetJ7_4: U3.14(2Y2) ; port Y9
NetJ7_5: U3.16(2Y3) ; port Y10
NetJ7_6: U3.17(2Y4) ; port Y11
NetJ7_7: U3.19(2Y5) ; port Y12
NetJ7_8: U3.20(2Y6) ; port Y13
NetJ7_9: U3.22(2Y7) ; port Y14
NetJ7_10: U3.23(2Y8) ; port Y15
NetR4_1: R4.1 U4.20(~{CE}) ; port CE0
NetR5_1: R5.1 U4.27(~{WE}) ; port WE0
NetR6_1: R6.1 U4.22(~{OE}) ; port OE0
NetR7_1: R7.1 U5.20(~{CE}) ; port CE1
NetR8_1: R8.1 U5.27(~{WE}) ; port WE1
NetR9_1: R9.1 U5.22(~{OE}) ; port OE1
NetR10_2: R10.2 U3.1(1~{OE1}) U3.24(2~{OE1}) U3.25(2~{OE2}) U3.48(1~{OE2}) ; port BOE
NetU1_AA1: U4.23(A11) ; port A11
NetU1_AA2: U4.21(A10) ; port A10
NetU1_M7: U5.6(A4) ; port A20
NetU1_M8: U5.7(A3) ; port A21
NetU1_M16: U3.47(1A1) ; port B0
NetU1_M17: U3.38(1A7) ; port B6
NetU1_M18: U3.37(1A8) ; port B7
NetU1_N6: U4.2(A12) ; port A12
NetU1_N7: U4.26(A13) ; port A13
NetU1_N15: U3.46(1A2) ; port B1
NetU1_N16: U3.41(1A5) ; port B4
NetU1_P4: U4.24(A9) ; port A9
NetU1_P5: U4.25(A8) ; port A8
NetU1_P6: U5.9(A1) ; port A16
NetU1_P7: U5.8(A2) ; port A17
NetU1_P8: U4.9(A1) ; port A1
NetU1_P16: U3.40(1A6) ; port B5
NetU1_P17: U3.33(2A3) ; port B10
NetU1_P18: U3.32(2A4) ; port B11
NetU1_R4: U5.5(A5) ; port A19
NetU1_R7: U4.10(A0) ; port A0
NetU1_R15: U3.36(2A1) ; port B8
NetU1_R16: U3.35(2A2) ; port B9
NetU1_R17: U3.30(2A5) ; port B12
NetU1_T3: U5.4(A6) ; port A18
NetU1_T4: U5.10(A0) ; port A15
NetU1_T5: U4.5(A5) ; port A5
NetU1_T6: U4.6(A4) ; port A4
NetU1_T17: U3.29(2A6) ; port B13
NetU1_T18: U3.26(2A8) ; port B15
NetU1_T19: U3.27(2A7) ; port B14
NetU1_T20: U3.43(1A4) ; port B3
NetU1_U1: U5.3(A7) ; port A29
NetU1_U3: U5.26(A13) ; port A28
NetU1_U4: U4.1(A14) ; port A14
NetU1_U19: U3.44(1A3) ; port B2
NetU1_V1: U5.2(A12) ; port A27
NetU1_V2: U5.24(A9) ; port A26
NetU1_V3: U4.3(A7) ; port A7
NetU1_V5: U4.4(A6) ; port A6
NetU1_W1: U5.21(A10) ; port A25
NetU1_W3: U5.25(A8) ; port A24
NetU1_W4: U4.8(A2) ; port A2
NetU1_Y1: U5.23(A11) ; port A23
NetU1_Y2: U5.1(A14) ; port A22
NetU1_Y3: U4.7(A3) ; port A3

### Library data of the parts
R4-R10 = CMP-2100-03673-1: as R1 on sheet spartan6-2; Height: 0.5mm; Depth: 1.25mm; Case Code (Imperial): 0805; Lead Free: LeadFree; Military Standard: Not; Package Description: 2-Pin Surface Mounted Device, Body 2 x 1.25 mm; Case Code (Metric): 2012; Composition: ThickFilm; Voltage Rating: 150V; Manufacturer URL: http://www.yageo.com/; Packaging: TapeandReel; Package Reference: 0805; REACH SVHC: Unknown; Tolerance: 5%; Case/Package: 0805; Max Operating Temperature: 155degC; Number of Pins: 2; Min Operating Temperature: -55degC; RoHSCompliant: true; Length: 2mm; Datasheet URL: http://www.yageo.com/NewPortal/yageodocoutput?fileName=/pdf/R-Chip/PYu-RC_Group_51_RoHS_L_5.pdf; Termination: SMD/SMT; Radiation Hardening: No; Width: 1.25mm; Contact Plating: Tin; Datasheet Version: Rev. 5, 10/2016
U3 = CMP-0440-00612-3: 16-Bit Buffers/Drivers With 3-State Outputs, DL0048A, TUBE; Manufacturer: Texas Instruments; VCC(Min)(V): 4.5; VCC(Max)(V): 5.5; Input Type: TTL; F @ Nom Voltage(Max)(Mhz): 150; Rating: Catalog; ICC @ Nom Voltage(Max)(mA): 0.034; Bits(#): 16; Voltage(Nom)(V): 5; tpd @ Nom Voltage(Max)(ns): 4.2; PackageVersion: http://www.ti.com/lit/ml/mpds490/mpds490.pdf; PackageReference: DL0048A; Code_JEDEC: MO-118; Operating Temperature Range(C): -40 to 85; Generic Part Number: SN74ABT16541A; DatasheetVersion: SCBS118C; Output Type: TTL
U4 U5 = CMP-0515-00096-2: 256 K Low Voltage CMOS SRAM, 32 K x 8, -40 to 85 degC, 28-Pin SOP (TSOP-1-28), Pb-Free; Manufacturer: Integrated Silicon Solution Inc (ISSI); Density: 256K; Organization: 32K x 8; Speed (ns): 20; Packing: Tray / Tube; RoHS: Pb-Free; ComponentLink2Description: Datasheet; Mounting Technology: Surface Mount; ComponentLink2URL: http://www.issi.com/WW/pdf/62-65LV256AL.pdf; ComponentLink3URL: http://www.issi.com/WW/pdf/62-65C256AL.pdf; ComponentLink1URL: http://www.issi.com/US/index.shtml; ComponentLink1Description: Manufacturer URL; ComponentLink3Description: Package Specification; PackageVersion: Rev. F, 09/2009; PackageReference: TSOP-1-28; Code_JEDEC: MO- 183; PartNumber: IS62LV256AL-20TLI; PackageDescription: 28-Pin 8 x 13.4 mm TSOP-1, Pitch 0.55 mm; DatasheetVersion: Rev. C

## Sheet POWER.SchDoc
size A; SheetNumber: 5; SheetTotal: 8
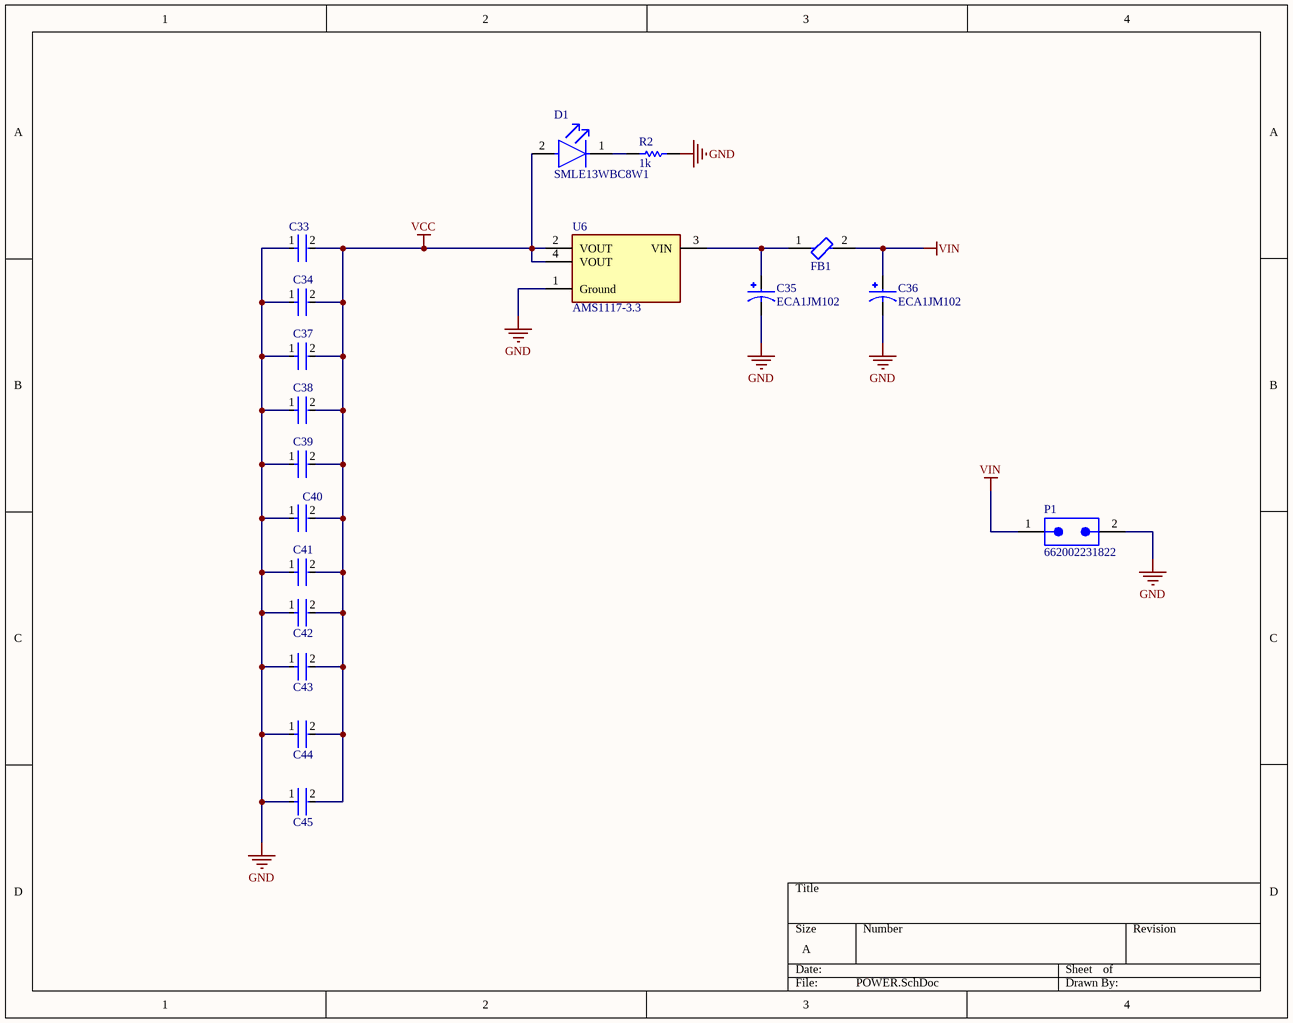
[diagram p4: POWER.SchDoc]

### Parts
C33  C0603X6S0G474M030BC  [FP-C0603-030-0_03-MFG]  (value not drawn)
C34  C0603X6S0G474M030BC  [FP-C0603-030-0_03-MFG]  (value not drawn)
C35  ECA1JM102  [CAPPRD750W80D1600H2500]
C36  ECA1JM102  [CAPPRD750W80D1600H2500]
C37  C0603X6S0G474M030BC  [FP-C0603-030-0_03-MFG]  (value not drawn)
C38  C0603X6S0G474M030BC  [FP-C0603-030-0_03-MFG]  (value not drawn)
C39  C0603X6S0G474M030BC  [FP-C0603-030-0_03-MFG]  (value not drawn)
C40  C0603X6S0G474M030BC  [FP-C0603-030-0_03-MFG]  (value not drawn)
C41  C0603X6S0G474M030BC  [FP-C0603-030-0_03-MFG]  (value not drawn)
C42  C0603X6S0G474M030BC  [FP-C0603-030-0_03-MFG]  (value not drawn)
C43  C0603X6S0G474M030BC  [FP-C0603-030-0_03-MFG]  (value not drawn)
C44  C0603X6S0G474M030BC  [FP-C0603-030-0_03-MFG]  (value not drawn)
C45  C0603X6S0G474M030BC  [FP-C0603-030-0_03-MFG]  (value not drawn)
D1  SMLE13WBC8W1  [FP-SMLE13WBC8W1-MFG]
FB1  BLM18KG121TN1D  [FP-BLM18-0_15-t0_6-d1_2-IPC_A]  (value not drawn)
P1  662002231822  [662002231822]
R2  1k  [RESC2013X60X35ML10T20]
U6  AMS1117-3.3  [FP-AMS1117-IPC_C]

### Nets
GND: C33.1 C34.1 C35.N C36.N C37.1 C38.1 C39.1 C40.1 C41.1 C42.1 C43.1 C44.1 C45.1 P1.2 R2.1 U6.1(Ground)
VCC: C33.2 C34.2 C37.2 C38.2 C39.2 C40.2 C41.2 C42.2 C43.2 C44.2 C45.2 D1.2(A) U6.2(VOUT) U6.4(VOUT)
VIN: C36.P FB1.2 P1.1
NetC35_P: C35.P FB1.1 U6.3(VIN)
NetD1_1: D1.1(C) R2.2

### Library data of the parts
C33 C34 C37-C45 = CMP-08246-002636-1: as C1 on sheet spartan6-2; Dielectric Material: Ceramic; RoHS Compliant: Yes; Case Code (Imperial): 0201; Voltage Rating: 4V; Series: C; Case/Package: 0201; Max Operating Temperature: 105°C; Width: 0.3mm; Termination: SMD/SMT; Lead Free: Lead Free; Capacitance: 470nF; Tolerance: 20%; Mount: Surface Mount; Thickness: 0.013inch; Package Quantity: 15000; Case Code (Metric): 0603; Height: 0.3mm; Weight: 6E-06oz; Length: 0.024inch; Packaging: Tape and Reel; Min Operating Temperature: -55°C; Voltage Rating (DC): 4V; Dielectric: X6S
C35 C36 = ECA1JM102: 1000ÂµF 63V Aluminum Electrolytic Capacitors Radial, Can 2000 Hrs @ 85Â°C; MF: Panasonic; Availability: Not in stock; Check_prices: https://www.snapeda.com/parts/ECA1JM102/Panasonic/view-part/5782477/?ref=eda; Package: RADIAL-2 Panasonic; SnapEDA_Link: https://www.snapeda.com/parts/ECA1JM102/Panasonic/view-part/5782477/?ref=snap; MP: ECA1JM102; Price: None; Value: *
D1 = CMP-08952-000004-1: as D3 on sheet spartan6-2; Temperature Range Low: -40°C; Digikey Description: LED WHITE 0603 SMD; Temperature Range High: +85°C; Temperature: -40°C to +85°C; Manufacturer Part Number: SMLE13WBC8W1; Colour: White; Mouser Description: Standard LEDs - SMD ExceLED White LED 120mcd 5mA; Octopart: https://octopart.com/smle13wbc8w1-rohm-22224565; Automotive: No; Device Class L2: LEDs; Lead Free: Yes; ComponentLink2URL: https://media.digikey.com/pdf/Data%20Sheets/Rohm%20PDFs/SMLE13WBC8W1_Spec.pdf; Device Class L3: unset; Package: 0; RoHS: TRUE; Height: 0.4mm; Category: Diode; Device Class L1: Optoelectronics; ComponentLink2Description: Datasheet
FB1 = CMP-0686-00554-8: FERRITE BEAD 120 OHM 0603 1LN; Max Current Rating: 3A; DC Resistance (DCR): 30mR; Impedance: 120R; Number of Lines: 1; Test Frequency: 100MHz; Tolerance: 25%; Package Quantity: 4000; Min Operating Temperature: -55°C; Termination: SMD/SMT; REACH SVHC: No SVHC; Core Material: Ferrite; Material: Ferrite; Current Rating: 3A; Height: 0.8mm; Number of Pins: 2; Case/Package: 0603; Case Code (Imperial): 0603; Series: BLM18K; Packaging: Tape and Reel; Inductor Type: FERRITE BEAD; Lead Free: Lead Free; Width: 0.8mm; Case Code (Metric): 1608; Number of Circuits: 1; Max DC Current: 3A; Depth: 0.95mm; Max Operating Temperature: 125°C; Length: 1.6mm; RoHS Compliant: Yes
P1 = CMP-1502-00340-2: NexarPartId: 8917600; Contact Resistance: 10mΩ; Connector Type: Male Pin, Socket; Row Spacing: 2.9972mm; Number of Contacts: 2; Gender: Male; Operating Supply Voltage: 250V; Current Rating: 5A; Pitch: 3mm; Insulation Resistance: 1GΩ; Contact Material: Copper; Lead Pitch: 3mm; Mount: Surface Mount; Number of Pins: 2; Max Operating Temperature: 105°C; Contact Plating: Tin; RoHS: Compliant; Color: Black; Width: 6.7mm; Termination: Solder; Fastening Type: Ramp; Number of Rows: 2; Height: 9.9mm; Min Operating Temperature: -40°C; Length: 6.7mm; Orientation: Vertical; REACH SVHC: Unknown; Housing Material: Nylon; Number of Positions: 2
R2 = CMP-2100-03673-1: as R1 on sheet spartan6-2; Height: 0.5mm; Depth: 1.25mm; Case Code (Imperial): 0805; Lead Free: LeadFree; Military Standard: Not; Package Description: 2-Pin Surface Mounted Device, Body 2 x 1.25 mm; Case Code (Metric): 2012; Composition: ThickFilm; Voltage Rating: 150V; Manufacturer URL: http://www.yageo.com/; Packaging: TapeandReel; Package Reference: 0805; REACH SVHC: Unknown; Tolerance: 5%; Case/Package: 0805; Max Operating Temperature: 155degC; Number of Pins: 2; Min Operating Temperature: -55degC; RoHSCompliant: true; Length: 2mm; Datasheet URL: http://www.yageo.com/NewPortal/yageodocoutput?fileName=/pdf/R-Chip/PYu-RC_Group_51_RoHS_L_5.pdf; Termination: SMD/SMT; Radiation Hardening: No; Width: 1.25mm; Contact Plating: Tin; Datasheet Version: Rev. 5, 10/2016
U6 = CMP-209535-000001-1: as U2 on sheet spartan6-2; Height: 1.8mm; Package: AMS1117; Device Class L2: Power Management ICs; ComponentLink2Description: Datasheet; ComponentLink2URL: http://www.advanced-monolithic.com/pdf/ds1117.pdf; Category: IC; RoHS: TRUE; Automotive: No; Device Class L1: Integrated Circuits (ICs); Output Current: 1A; Device Class L3: Voltage Regulators - Linear; Temperature: -40°C to +125°C; Output Voltage: 3.3V; Manufacturer Part Number: AMS1117-3.3; Temperature Range Low: -40°C; Octopart: https://octopart.com/ams1117-3.3-advanced+monolithic+systems-25899300; Lead Free: Yes; Ipc Land Pattern Name: SOT229P700X180-4; Temperature Range High: +125°C

## Sheet CONNECTORS.SchDoc
size A; SheetNumber: 6; SheetTotal: 8
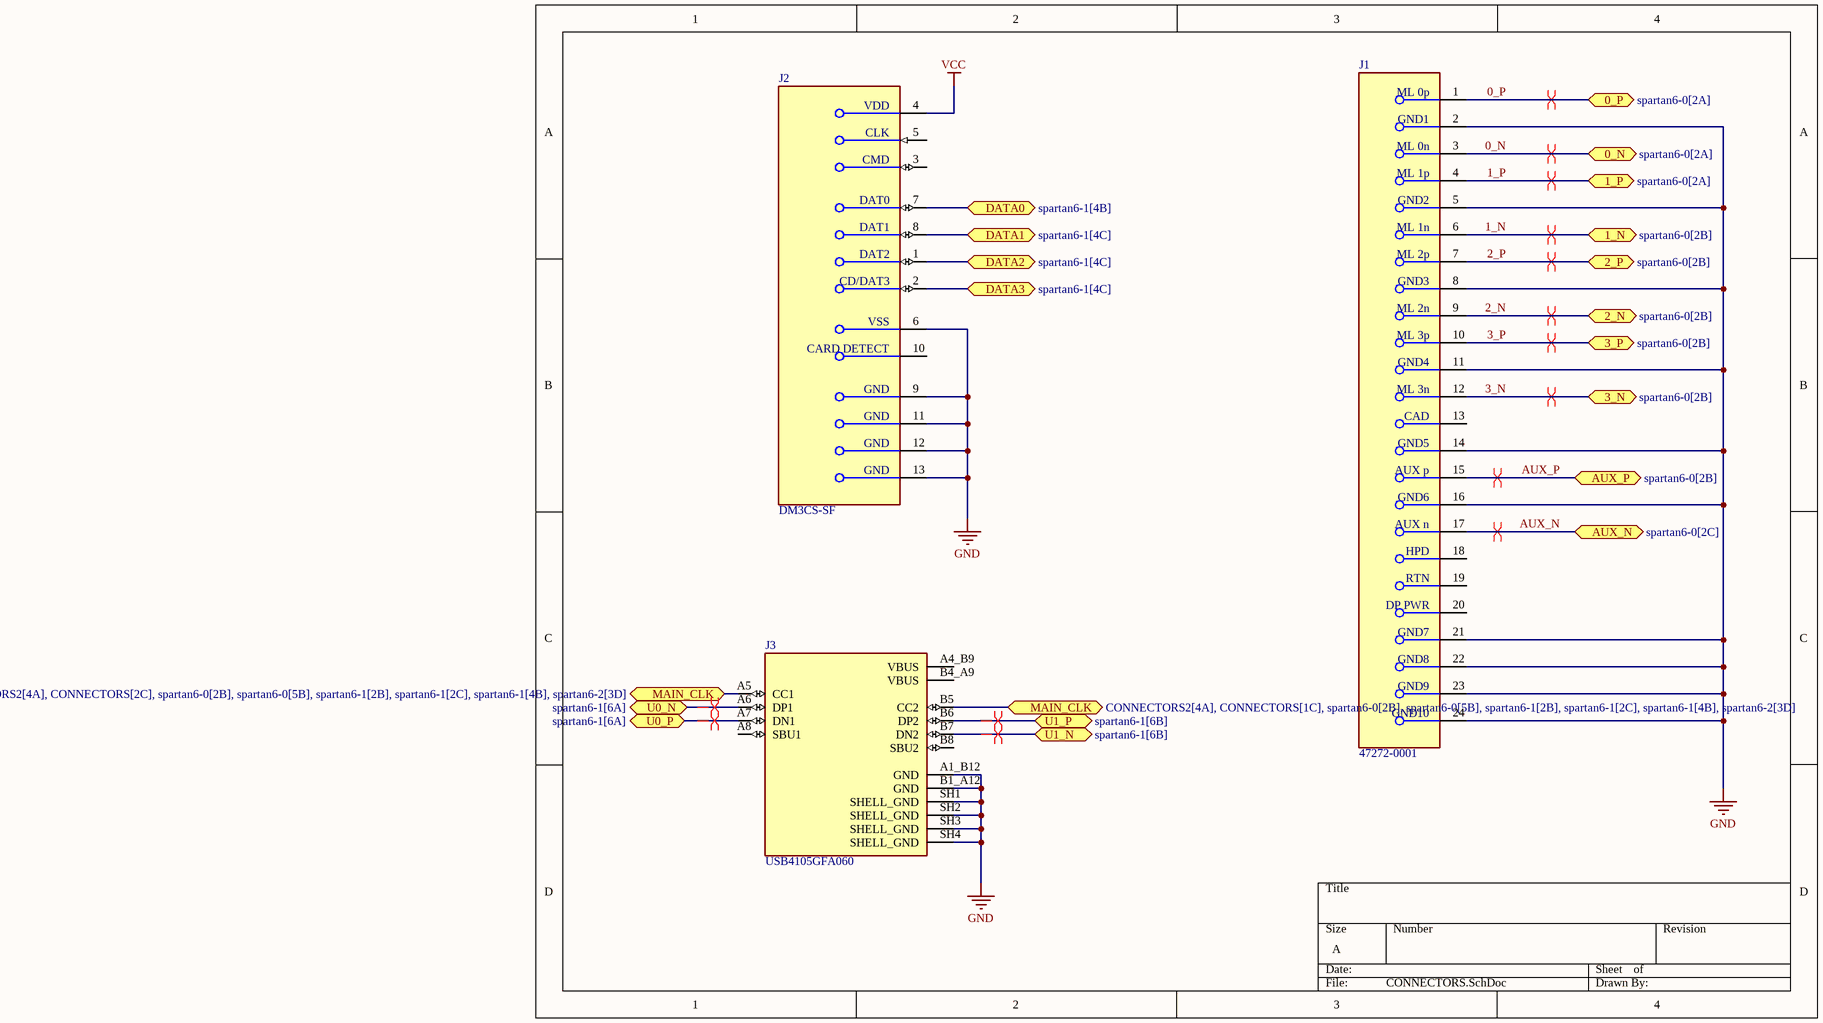
[diagram p5: CONNECTORS.SchDoc]

### Parts
J1  47272-0001  [FP-47272-0001-MFG]
J2  DM3CS-SF  [FP-DM3CS-SF-MFG]
J3  USB4105GFA060  [GCT_USB4105GFA060]

### Ports
0_N (bidir, see spartan6-0[2A]), 0_P (bidir, see spartan6-0[2A]), 1_N (bidir, see spartan6-0[2B]), 1_P (bidir, see spartan6-0[2A]), 2_N (bidir, see spartan6-0[2B]), 2_P (bidir, see spartan6-0[2B]), 3_N (bidir, see spartan6-0[2B]), 3_P (bidir, see spartan6-0[2B]), AUX_N (bidir, see spartan6-0[2C]), AUX_P (bidir, see spartan6-0[2B]), DATA0 (bidir, see spartan6-1[4B]), DATA1 (bidir, see spartan6-1[4C]), DATA2 (bidir, see spartan6-1[4C]), DATA3 (bidir, see spartan6-1[4C]), MAIN_CLK (bidir, see CONNECTORS2[4A], CONNECTORS[1C], spartan6-0[2B], spartan6-0[5B], spartan6-1[2B], spartan6-1[2C], spartan6-1[4B], spartan6-2[3D]), MAIN_CLK (bidir, see CONNECTORS2[4A], CONNECTORS[2C], spartan6-0[2B], spartan6-0[5B], spartan6-1[2B], spartan6-1[2C], spartan6-1[4B], spartan6-2[3D]), U0_N (bidir, see spartan6-1[6A]), U0_P (bidir, see spartan6-1[6A]), U1_N (bidir, see spartan6-1[6B]), U1_P (bidir, see spartan6-1[6B])

### Nets
GND: J1.2(GND1) J1.5(GND2) J1.8(GND3) J1.11(GND4) J1.14(GND5) J1.16(GND6) J1.21(GND7) J1.22(GND8) J1.23(GND9) J1.24(GND10) J2.6(VSS) J2.9(GND) J2.11(GND) J2.12(GND) J2.13(GND) J3.A1_B12(GND) J3.B1_A12(GND) J3.SH1(SHELL_GND) J3.SH2(SHELL_GND) J3.SH3(SHELL_GND) J3.SH4(SHELL_GND)
VCC: J2.4(VDD)
0_N: J1.3(ML_0n) ; port 0_N
0_P: J1.1(ML_0p) ; port 0_P
1_N: J1.6(ML_1n) ; port 1_N
1_P: J1.4(ML_1p) ; port 1_P
2_N: J1.9(ML_2n) ; port 2_N
2_P: J1.7(ML_2p) ; port 2_P
3_N: J1.12(ML_3n) ; port 3_N
3_P: J1.10(ML_3p) ; port 3_P
AUX_N: J1.17(AUX_n) ; port AUX_N
AUX_P: J1.15(AUX_p) ; port AUX_P
clk: J3.A5(CC1) J3.B5(CC2) ; port MAIN_CLK
U0_N: J3.A6(DP1) ; port U0_N
U0_P: J3.A7(DN1) ; port U0_P
U1_N: J3.B7(DN2) ; port U1_N
U1_P: J3.B6(DP2) ; port U1_P
NetJ2_1: J2.1(DAT2) ; port DATA2
NetJ2_2: J2.2(CD/DAT3) ; port DATA3
NetJ2_7: J2.7(DAT0) ; port DATA0
NetJ2_8: J2.8(DAT1) ; port DATA1

Not connected (* = marked no-connect by the designer): J1 13(CAD) 18(HPD) 19(RTN) 20(DP_PWR); J2 3(CMD) 5(CLK) 10(CARD_DETECT); J3 A4_B9(VBUS) A8(SBU1) B4_A9(VBUS) B8(SBU2)

### Layout directives
differential pair: 0_N, 0_P, 1_N, 1_P, 2_N, 2_P, 3_N, 3_P, AUX_N, AUX_P, U0_N, U0_P, U1_N, U1_P

### Library data of the parts
J1 = CMP-2000-05608-2: CONN RCPT DISPLAYPORT 20P SMD RA; Manufacturer: Molex; Voltage Rating: 40V; Is Female: yes; Shielding: true; Number Of Contacts: 20; Conn Orientation: Right Angle; Current Rating: 0.5A; Pitch: 0.5mm; Device Class L2: Audio / Video Connectors; Temperature: -20°C to +85°C; Contact Material: Gold,Nickel; Footprint Url: https://www.molex.com/pdm_docs/sd/472720001_sd.pdf; Device Class L1: Connectors; ComponentLink2Description: Datasheet; Temperature Range Low: -20°C; Automotive: No; Package: 0; Height: 6.9mm; RoHS: TRUE; Octopart: https://octopart.com/47272-0001-molex-5441289; Lead Free: Yes; ComponentLink2URL: https://www.molex.com/webdocs/datasheets/pdf/en-us/0472720001_IO_CONNECTORS.pdf; Device Class L3: unset; Mouser Description: HDMI, Displayport & DVI Connectors .5MM RA SMT RCPT; Category: Conn; Manufacturer Part Number: 47272-0001; Digikey Description: CONN RCPT DISPLAYPORT 20P SMD RA; Temperature Range High: +85°C
J2 = CMP-11597-000003-1: CONN MICRO SD CARD HINGED TYPE; Pitch: 1.1mm; Connector Type: Connector; Current Rating: 500mA; Voltage Rating (AC): 125V; Gender: Female; Insulation Resistance: 1GR; Number of Positions: 8; Contact Resistance: 100mR; Packaging: Tape and Reel; Flammability Rating: UL94 V-0; Lead Free: Lead Free; Min Operating Temperature: -25°C; Orientation: Right Angle; Width: 13.8mm; Number of Rows: 1; Housing Material: Polymer; Package Quantity: 1; Mount: Surface Mount; Max Current Rating: 500mA; Radiation Hardening: No; Max Operating Temperature: 85°C; Contact Plating: Gold; Depth: 1.83mm; Contact Material: Gold; Length: 14.1mm; Number of Contacts: 8; Termination: Solder
J3 = USB4105GFA060: MF: {'manufacturer': u'GCT'}; Package: None; Price: None; Value: *; MP: USB4105GFA060; Availability: Unavailable

## Sheet CONNECTORS2.SchDoc
size A; SheetNumber: 7; SheetTotal: 8
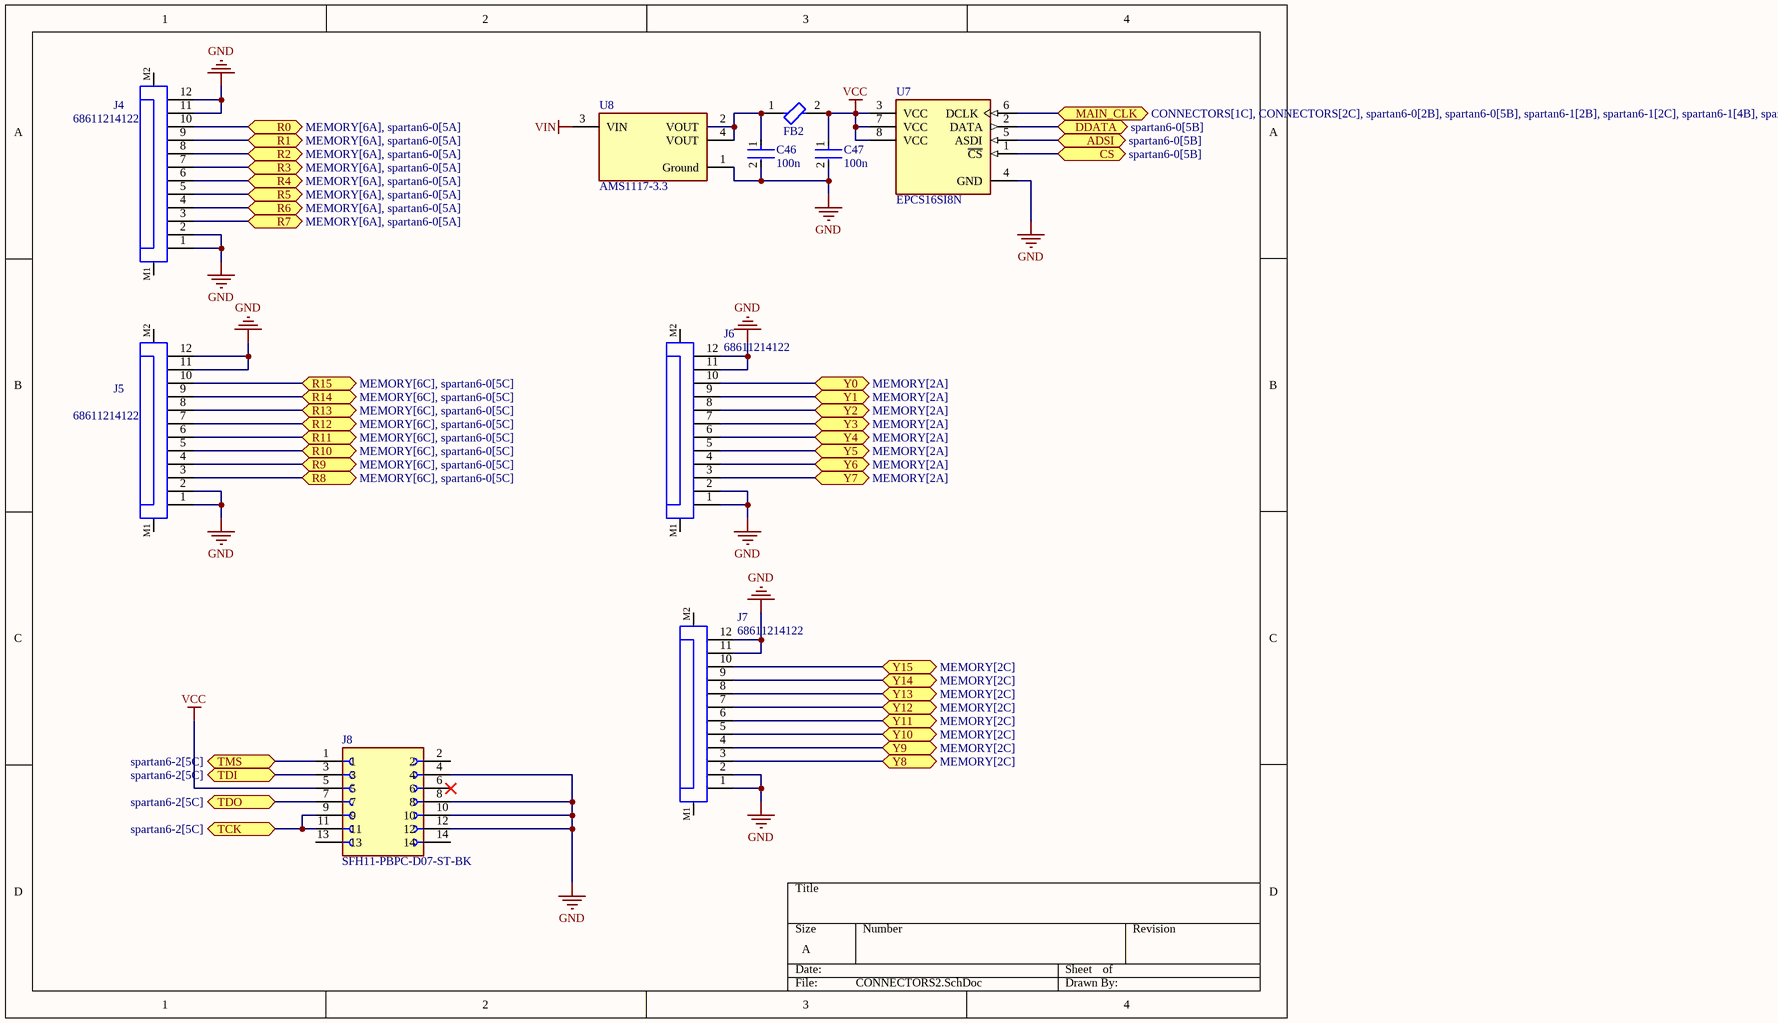
[diagram p6: CONNECTORS2.SchDoc]

### Parts
C46  100n  [FP-CL10-IPC_C]
C47  100n  [FP-CL10-IPC_C]
FB2  BLM18KG121TN1D  [FP-BLM18-0_15-t0_6-d1_2-IPC_A]  (value not drawn)
J4  68611214122  [68611214122]
J5  68611214122  [68611214122]
J6  68611214122  [68611214122]
J7  68611214122  [68611214122]
J8  SFH11-PBPC-D07-ST-BK  [SULLINS_SFH11-PBPC-D07-ST-BK]
U7  EPCS16SI8N  [FP-SOIC-8-IPC_C]
U8  AMS1117-3.3  [FP-AMS1117-IPC_C]

### Ports
ADSI (bidir, see spartan6-0[5B]), CS (bidir, see spartan6-0[5B]), DDATA (bidir, see spartan6-0[5B]), MAIN_CLK (bidir, see CONNECTORS[1C], CONNECTORS[2C], spartan6-0[2B], spartan6-0[5B], spartan6-1[2B], spartan6-1[2C], spartan6-1[4B], spartan6-2[3D]), R0 (bidir, see MEMORY[6A], spartan6-0[5A]), R1 (bidir, see MEMORY[6A], spartan6-0[5A]), R2 (bidir, see MEMORY[6A], spartan6-0[5A]), R3 (bidir, see MEMORY[6A], spartan6-0[5A]), R4 (bidir, see MEMORY[6A], spartan6-0[5A]), R5 (bidir, see MEMORY[6A], spartan6-0[5A]), R6 (bidir, see MEMORY[6A], spartan6-0[5A]), R7 (bidir, see MEMORY[6A], spartan6-0[5A]), R8 (bidir, see MEMORY[6C], spartan6-0[5C]), R9 (bidir, see MEMORY[6C], spartan6-0[5C]), R10 (bidir, see MEMORY[6C], spartan6-0[5C]), R11 (bidir, see MEMORY[6C], spartan6-0[5C]), R12 (bidir, see MEMORY[6C], spartan6-0[5C]), R13 (bidir, see MEMORY[6C], spartan6-0[5C]), R14 (bidir, see MEMORY[6C], spartan6-0[5C]), R15 (bidir, see MEMORY[6C], spartan6-0[5C]), TCK (bidir, see spartan6-2[5C]), TDI (bidir, see spartan6-2[5C]), TDO (bidir, see spartan6-2[5C]), TMS (bidir, see spartan6-2[5C]), Y0 (bidir, see MEMORY[2A]), Y1 (bidir, see MEMORY[2A]), Y2 (bidir, see MEMORY[2A]), Y3 (bidir, see MEMORY[2A]), Y4 (bidir, see MEMORY[2A]), Y5 (bidir, see MEMORY[2A]), Y6 (bidir, see MEMORY[2A]), Y7 (bidir, see MEMORY[2A]), Y8 (bidir, see MEMORY[2C]), Y9 (bidir, see MEMORY[2C]), Y10 (bidir, see MEMORY[2C]), Y11 (bidir, see MEMORY[2C]), Y12 (bidir, see MEMORY[2C]), Y13 (bidir, see MEMORY[2C]), Y14 (bidir, see MEMORY[2C]), Y15 (bidir, see MEMORY[2C])

### Nets
GND: C46.2 C47.2 J4.1 J4.2 J4.11 J4.12 J5.1 J5.2 J5.11 J5.12 J6.1 J6.2 J6.11 J6.12 J7.1 J7.2 J7.11 J7.12 J8.4 J8.8 J8.10 J8.12 U7.4(GND) U8.1(Ground)
VCC: C47.1 FB2.2 J8.5 U7.3(VCC) U7.7(VCC) U7.8(VCC)
VIN: U8.3(VIN)
clk: U7.6(DCLK) ; port MAIN_CLK
NetC46_1: C46.1 FB2.1 U8.2(VOUT) U8.4(VOUT)
NetJ4_3: J4.3 ; port R7
NetJ4_4: J4.4 ; port R6
NetJ4_5: J4.5 ; port R5
NetJ4_6: J4.6 ; port R4
NetJ4_7: J4.7 ; port R3
NetJ4_8: J4.8 ; port R2
NetJ4_9: J4.9 ; port R1
NetJ4_10: J4.10 ; port R0
NetJ5_3: J5.3 ; port R8
NetJ5_4: J5.4 ; port R9
NetJ5_5: J5.5 ; port R10
NetJ5_6: J5.6 ; port R11
NetJ5_7: J5.7 ; port R12
NetJ5_8: J5.8 ; port R13
NetJ5_9: J5.9 ; port R14
NetJ5_10: J5.10 ; port R15
NetJ6_3: J6.3 ; port Y7
NetJ6_4: J6.4 ; port Y6
NetJ6_5: J6.5 ; port Y5
NetJ6_6: J6.6 ; port Y4
NetJ6_7: J6.7 ; port Y3
NetJ6_8: J6.8 ; port Y2
NetJ6_9: J6.9 ; port Y1
NetJ6_10: J6.10 ; port Y0
NetJ7_3: J7.3 ; port Y8
NetJ7_4: J7.4 ; port Y9
NetJ7_5: J7.5 ; port Y10
NetJ7_6: J7.6 ; port Y11
NetJ7_7: J7.7 ; port Y12
NetJ7_8: J7.8 ; port Y13
NetJ7_9: J7.9 ; port Y14
NetJ7_10: J7.10 ; port Y15
NetJ8_1: J8.1 ; port TMS
NetJ8_3: J8.3 ; port TDI
NetJ8_7: J8.7 ; port TDO
NetJ8_9: J8.9 J8.11 ; port TCK
NetU1_C17: U7.5(ASDI) ; port ADSI
NetU1_G16: U7.1(~{CS}) ; port CS
NetU1_H14: U7.2(DATA) ; port DDATA

Not connected (* = marked no-connect by the designer): J4 M1 M2; J5 M1 M2; J6 M1 M2; J7 M1 M2; J8 2 6* 13 14

### Library data of the parts
C46 C47 = CMP-13271-003017-1: Cap Ceramic 4.7uF 10V X5R ±10% Pad SMD 0603 +85°C T/R; Capacitance: 4.7uF; Case/Package: 0603; Packaging: Tape and Reel; Width: 0.031inch; Contact Plating: Tin; Thickness: 0.035inch; Package Quantity: 1; Voltage Rating: 10V; Case Code (Metric): 1608; Case Code (Imperial): 0603; Depth: 0.8mm; Height: 0.8mm; Tolerance: 10%; Max Operating Temperature: 85°C; Length: 1.6mm; Dielectric: X5R; Mount: Surface Mount; Radiation Hardening: No; Min Operating Temperature: -55°C
FB2 = CMP-0686-00554-8: as FB1 on sheet POWER; Package Quantity: 4000; Min Operating Temperature: -55°C; Termination: SMD/SMT; REACH SVHC: No SVHC; Core Material: Ferrite; Material: Ferrite; Current Rating: 3A; Height: 0.8mm; Number of Pins: 2; Case/Package: 0603; Case Code (Imperial): 0603; Series: BLM18K; Packaging: Tape and Reel; Inductor Type: FERRITE BEAD; Lead Free: Lead Free; Width: 0.8mm; Case Code (Metric): 1608; Number of Circuits: 1; Max DC Current: 3A; Depth: 0.95mm; Max Operating Temperature: 125°C; Length: 1.6mm; RoHS Compliant: Yes
J4-J7 = CMP-1502-01473-2: NexarPartId: 8917683; Actuator Material: Polyphenylene; Operating Supply Voltage: 125V; Number of Contacts: 12; Contact Resistance: 20mΩ; Gender: Male; Current Rating: 1A; Insulation Resistance: 100MΩ; Pitch: 1mm; Number of Rows: 1; Number of Pins: 12; REACH SVHC: Unknown; Flammability Rating: UL94 V-0; Packaging: Tape and Reel; Voltage Rating: 125V; Contact Plating: Tin; Number of Positions: 12; RoHS: Compliant; Min Operating Temperature: -25°C; Termination: Solder; Contact Material: Bronze, Tin; Lead Pitch: 1mm; Mount: Surface Mount; Width: 2.95mm; Max Operating Temperature: 85°C; Orientation: Horizontal; Length: 19mm; Housing Material: Polyphenylene
J8 = SFH11-PBPC-D07-ST-BK: 14 Position Header Connector Through Hole; MF: Sullins Connector; Value: *; Check_prices: https://www.snapeda.com/parts/SFH11-PBPC-D07-ST-BK/Sullins%20Connector%20Solutions/view-part/851415/?ref=eda; Availability: Warning; Package: None; SnapEDA_Link: https://www.snapeda.com/parts/SFH11-PBPC-D07-ST-BK/Sullins%20Connector%20Solutions/view-part/851415/?ref=snap; Purchase-URL: https://pricing.snapeda.com/search/part/SFH11-PBPC-D07-ST-BK/?ref=eda; Price: None; MP: SFH11-PBPC-D07-ST-BK
U7 = CMP-0215-00002-2: IC CONFIG DEVICE 16MBIT 8SOIC; Manufacturer: Intel; Obsolete Part: true; Interface: Other; Memory Type: FLASH; Nominal Supply Current: 15-20mA; Min Supply Voltage: 2.7V; Memory Size: 16Mbits; Max Junction Temp: +135°C; Standoff Height: 0.1mm; Frequency: 40MHz; Max Supply Voltage: 3.6V; Device Class L1: Integrated Circuits (ICs); Ambient Temperature Range Low: -40°C; Automotive: No; Ipc Land Pattern Name: SOIC127P600X155-8; Lead Free: Yes; Height: 1.75mm; Device Class L3: Flash; Temperature Range High: +135°C; Ambient Temperature Range High: +85°C; Manufacturer Part Number: EPCS16SI8N; ComponentLink2URL: https://www.intel.com/content/dam/www/programmable/us/en/pdfs/literature/hb/cfg/cyc_c51014.pdf; RoHS: TRUE; ComponentLink2Description: Datasheet; Digikey Description: IC CONFIG DEVICE 16MBIT 8SOIC; Octopart: https://octopart.com/epcs16si8n-intel-80907697; Package: SOIC-8; Temperature: to +135°C; Device Class L2: Memory; Footprint Url: https://www.intel.com/content/dam/www/programmable/us/en/pdfs/literature/packaging/04r00424-00.pdf; Category: IC; Mouser Description: FPGA - Configuration Memory IC - Ser. Config Mem Flash 16Mb 40 MHz
U8 = CMP-209535-000001-1: as U2 on sheet spartan6-2; Height: 1.8mm; Package: AMS1117; Device Class L2: Power Management ICs; ComponentLink2Description: Datasheet; ComponentLink2URL: http://www.advanced-monolithic.com/pdf/ds1117.pdf; Category: IC; RoHS: TRUE; Automotive: No; Device Class L1: Integrated Circuits (ICs); Output Current: 1A; Device Class L3: Voltage Regulators - Linear; Temperature: -40°C to +125°C; Output Voltage: 3.3V; Manufacturer Part Number: AMS1117-3.3; Temperature Range Low: -40°C; Octopart: https://octopart.com/ams1117-3.3-advanced+monolithic+systems-25899300; Lead Free: Yes; Ipc Land Pattern Name: SOT229P700X180-4; Temperature Range High: +125°C